# Altium project ultrazohm_digital_voltage_3U_1vxx.PrjPCB (part 2 of 3)

## Sheet TI_DS26C31T.SchDoc
size A4; Author: T. Wendt; CompanyName: Technische Hochschule Nürnberg Georg Simon Ohm; Address1: Fürther Straße 250; Address2: 90429 Nürnberg; Address3: GERMANY; DocumentNumber: 7; SheetNumber: 7; SheetTotal: 16; CompanyName2: Institut ELSYS
Used 8 times, as channels SigCon_top/RS422_top/RS422A, SigCon_top/RS422_top/RS4221, SigCon_top/RS422_top/RS4222, SigCon_top/RS422_top/RS4223, SigCon_top/RS422_top/RS4224, SigCon_top/RS422_top/RS4225, SigCon_top/RS422_top/RS4226, SigCon_top/RS422_top/RS4227. Parts and nets are listed once, with the designators drawn on the sheet.
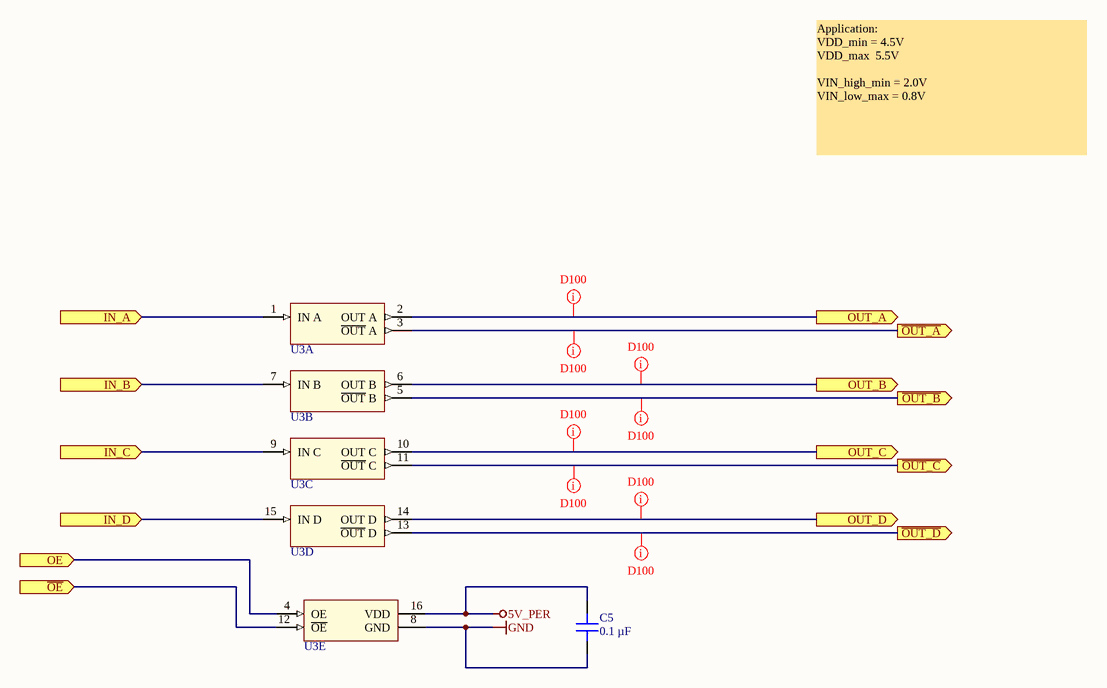
[diagram p9: TI_DS26C31T.SchDoc]

### Parts
C5  0.1 µF  [C_0603]
U3  DS26C31TMX/NOPB  [TI_D-R-PDSO-G16_N]  (value not drawn)  (parts A,B,C,D,E of 5)

### Ports
IN_A (in), IN_B (in), IN_C (in), IN_D (in), OE (in), OUT_A (out), OUT_B (out), OUT_C (out), OUT_D (out), ~{OE} (in), ~{OUT_A} (out), ~{OUT_B} (out), ~{OUT_C} (out), ~{OUT_D} (out)

### Nets
5V_PER: C5.2 U3.16(VDD)
GND: C5.1 U3.8(GND)
IN_A: U3.1(IN_A) ; port IN_A
IN_B: U3.7(IN_B) ; port IN_B
IN_C: U3.9(IN_C) ; port IN_C
IN_D: U3.15(IN_D) ; port IN_D
~{OE}: U3.12(~{OE}) ; port ~{OE}
~{OUT_A}: U3.3(~{OUT}_A) ; port ~{OUT_A}
~{OUT_B}: U3.5(~{OUT}_B) ; port ~{OUT_B}
~{OUT_C}: U3.11(~{OUT}_C) ; port ~{OUT_C}
~{OUT_D}: U3.13(~{OUT}_D) ; port ~{OUT_D}
OE: U3.4(OE) ; port OE
OUT_A: U3.2(OUT_A) ; port OUT_A
OUT_B: U3.6(OUT_B) ; port OUT_B
OUT_C: U3.10(OUT_C) ; port OUT_C
OUT_D: U3.14(OUT_D) ; port OUT_D

### Channels
SigCon_top/RS422_top/RS422A: designators end in A; ports IN_A=GND IN_B=GND IN_C=DIG_IO_5V_F5 IN_D=DIG_IO_5V_E5 OE=ENABLE OUT_A=NetU3A_2 OUT_B=NetU3A_6 OUT_C=DIG_I_DIFF_C_P8 OUT_D=DIG_I_DIFF_A_P8 ~{OE}=5V_PER ~{OUT_A}=NetU3A_3 ~{OUT_B}=NetU3A_5 ~{OUT_C}=DIG_I_DIFF_C_N8 ~{OUT_D}=DIG_I_DIFF_A_N8
SigCon_top/RS422_top/RS4221: designators end in B; ports IN_A=DIG_IO_5V_D1 IN_B=DIG_IO_5V_C1 IN_C=DIG_IO_5V_A1 IN_D=DIG_IO_5V_B1 OE=ENABLE OUT_A=DIG_I_DIFF_D_P1 OUT_B=DIG_I_DIFF_C_P1 OUT_C=DIG_I_DIFF_A_P1 OUT_D=DIG_I_DIFF_B_P1 ~{OE}=5V_PER ~{OUT_A}=DIG_I_DIFF_D_N1 ~{OUT_B}=DIG_I_DIFF_C_N1 ~{OUT_C}=DIG_I_DIFF_A_N1 ~{OUT_D}=DIG_I_DIFF_B_N1
SigCon_top/RS422_top/RS4222: designators end in C; ports IN_A=DIG_IO_5V_B2 IN_B=DIG_IO_5V_A2 IN_C=DIG_IO_5V_E1 IN_D=DIG_IO_5V_F1 OE=ENABLE OUT_A=DIG_I_DIFF_D_P2 OUT_B=DIG_I_DIFF_C_P2 OUT_C=DIG_I_DIFF_A_P2 OUT_D=DIG_I_DIFF_B_P2 ~{OE}=5V_PER ~{OUT_A}=DIG_I_DIFF_D_N2 ~{OUT_B}=DIG_I_DIFF_C_N2 ~{OUT_C}=DIG_I_DIFF_A_N2 ~{OUT_D}=DIG_I_DIFF_B_N2
SigCon_top/RS422_top/RS4223: designators end in D; ports IN_A=DIG_IO_5V_F2 IN_B=DIG_IO_5V_E2 IN_C=DIG_IO_5V_C2 IN_D=DIG_IO_5V_D2 OE=ENABLE OUT_A=DIG_I_DIFF_D_P3 OUT_B=DIG_I_DIFF_C_P3 OUT_C=DIG_I_DIFF_A_P3 OUT_D=DIG_I_DIFF_B_P3 ~{OE}=5V_PER ~{OUT_A}=DIG_I_DIFF_D_N3 ~{OUT_B}=DIG_I_DIFF_C_N3 ~{OUT_C}=DIG_I_DIFF_A_N3 ~{OUT_D}=DIG_I_DIFF_B_N3
SigCon_top/RS422_top/RS4224: designators end in E; ports IN_A=DIG_IO_5V_D3 IN_B=DIG_IO_5V_C3 IN_C=DIG_IO_5V_A3 IN_D=DIG_IO_5V_B3 OE=ENABLE OUT_A=DIG_I_DIFF_D_P4 OUT_B=DIG_I_DIFF_C_P4 OUT_C=DIG_I_DIFF_A_P4 OUT_D=DIG_I_DIFF_B_P4 ~{OE}=5V_PER ~{OUT_A}=DIG_I_DIFF_D_N4 ~{OUT_B}=DIG_I_DIFF_C_N4 ~{OUT_C}=DIG_I_DIFF_A_N4 ~{OUT_D}=DIG_I_DIFF_B_N4
SigCon_top/RS422_top/RS4225: designators end in F; ports IN_A=DIG_IO_5V_B4 IN_B=DIG_IO_5V_A4 IN_C=DIG_IO_5V_E3 IN_D=DIG_IO_5V_F3 OE=ENABLE OUT_A=DIG_I_DIFF_D_P5 OUT_B=DIG_I_DIFF_C_P5 OUT_C=DIG_I_DIFF_A_P5 OUT_D=DIG_I_DIFF_B_P5 ~{OE}=5V_PER ~{OUT_A}=DIG_I_DIFF_D_N5 ~{OUT_B}=DIG_I_DIFF_C_N5 ~{OUT_C}=DIG_I_DIFF_A_N5 ~{OUT_D}=DIG_I_DIFF_B_N5
SigCon_top/RS422_top/RS4226: designators end in G; ports IN_A=DIG_IO_5V_F4 IN_B=DIG_IO_5V_E4 IN_C=DIG_IO_5V_C4 IN_D=DIG_IO_5V_D4 OE=ENABLE OUT_A=DIG_I_DIFF_D_P6 OUT_B=DIG_I_DIFF_C_P6 OUT_C=DIG_I_DIFF_A_P6 OUT_D=DIG_I_DIFF_B_P6 ~{OE}=5V_PER ~{OUT_A}=DIG_I_DIFF_D_N6 ~{OUT_B}=DIG_I_DIFF_C_N6 ~{OUT_C}=DIG_I_DIFF_A_N6 ~{OUT_D}=DIG_I_DIFF_B_N6
SigCon_top/RS422_top/RS4227: designators end in H; ports IN_A=DIG_IO_5V_D5 IN_B=DIG_IO_5V_C5 IN_C=DIG_IO_5V_A5 IN_D=DIG_IO_5V_B5 OE=ENABLE OUT_A=DIG_I_DIFF_D_P7 OUT_B=DIG_I_DIFF_C_P7 OUT_C=DIG_I_DIFF_A_P7 OUT_D=DIG_I_DIFF_B_P7 ~{OE}=5V_PER ~{OUT_A}=DIG_I_DIFF_D_N7 ~{OUT_B}=DIG_I_DIFF_C_N7 ~{OUT_C}=DIG_I_DIFF_A_N7 ~{OUT_D}=DIG_I_DIFF_B_N7

### Layout directives
net class D100: DIG_I_DIFF_A_N8, DIG_I_DIFF_A_P8, DIG_I_DIFF_C_N8, DIG_I_DIFF_C_P8, NetU3A_2, NetU3A_3, NetU3A_5, NetU3A_6

### Notes on the sheet
- Application:
  VDD_min = 4.5V
  VDD_max  5.5V
  VIN_high_min = 2.0V
  VIN_low_max = 0.8V
- Title
- Size:
- Date:
- A4
- Revision:
- Time:
- Sheet
- of
- Author:
- Project:

### Library data of the parts
C5 = C0603X104K5RAC7411: as C1 on sheet TI_SN74LVCH16T245; Manufacturer Part Number: C0603X104K5RAC7411; PartID: 3; Created On: 20.12.2020 13:54:13; ComponentLink1Description: Datasheet; ComponentLink1URL: https://www.mouser.de/datasheet/2/212/1/KEM_C1013_X7R_FT_CAP_SMD-1103280.pdf; Component Type: Capacitor 0603; Device Package: 0603; Last Updated: 04.03.2021 09:24:28; Mounting Type: SMD; Operating Temperature: -55 - 125°C; Series: SMD Comm X7R Flex; Supplier 1: Mouser; Supplier Part Number 1: 80-C0603X104K5R7411; Type: Capacitor; Value: 0.1 µF; Live Cycle Status: 1; Stock number: Labor SMD Container; LCSC Part Number: C14663; Supplier 2: LCSC; Supplier Part Number 2: C14663
U3 = DS26C31TMX/NOPB: CMOS Quad Tri-State Differential Line Drivers, 16-pin Narrow SOIC, Pb-Free; Manufacturer: Texas Instruments; Created from: T. Wendt; PartID: 1; Created On: 01.03.2021 10:08:45; ComponentLink1Description: Datasheet; ComponentLink1URL: http://www.ti.com/general/docs/lit/getliterature.tsp?genericPartNumber=DS26C31T&fileType=pdf; Component Type: RS422 Driver; Device Package: SOIC; Last Updated: 04.03.2021 09:04:43; Manufacturer Part Number: DS26C31TMX/NOPB; Minimum Order: 1; Mounting Type: SMD; Operating Temperature: -40°C - 85°C; Series: DS26C31; Supplier 1: Digi-Key; Supplier Part Number 1: DS26C31TMX/NOPBCT-ND; Supplier 2: Mouser; Supplier Part Number 2: 926-DS26C31TMX/NOPB; Type: Standard; Live Cycle Status: 1; LCSC Part Number: C132085; Stock number: not stored; Supplier 3: LCSC; Supplier Part Number 3: C132085

## Sheet DifferentialToSingle.SchDoc
size A4; Author: T. Wendt; CompanyName: Technische Hochschule Nürnberg Georg Simon Ohm; Address1: Fürther Straße 250; Address2: 90429 Nürnberg; Address3: GERMANY; DocumentNumber: 8; SheetNumber: 8; SheetTotal: 16; CompanyName2: Institut ELSYS
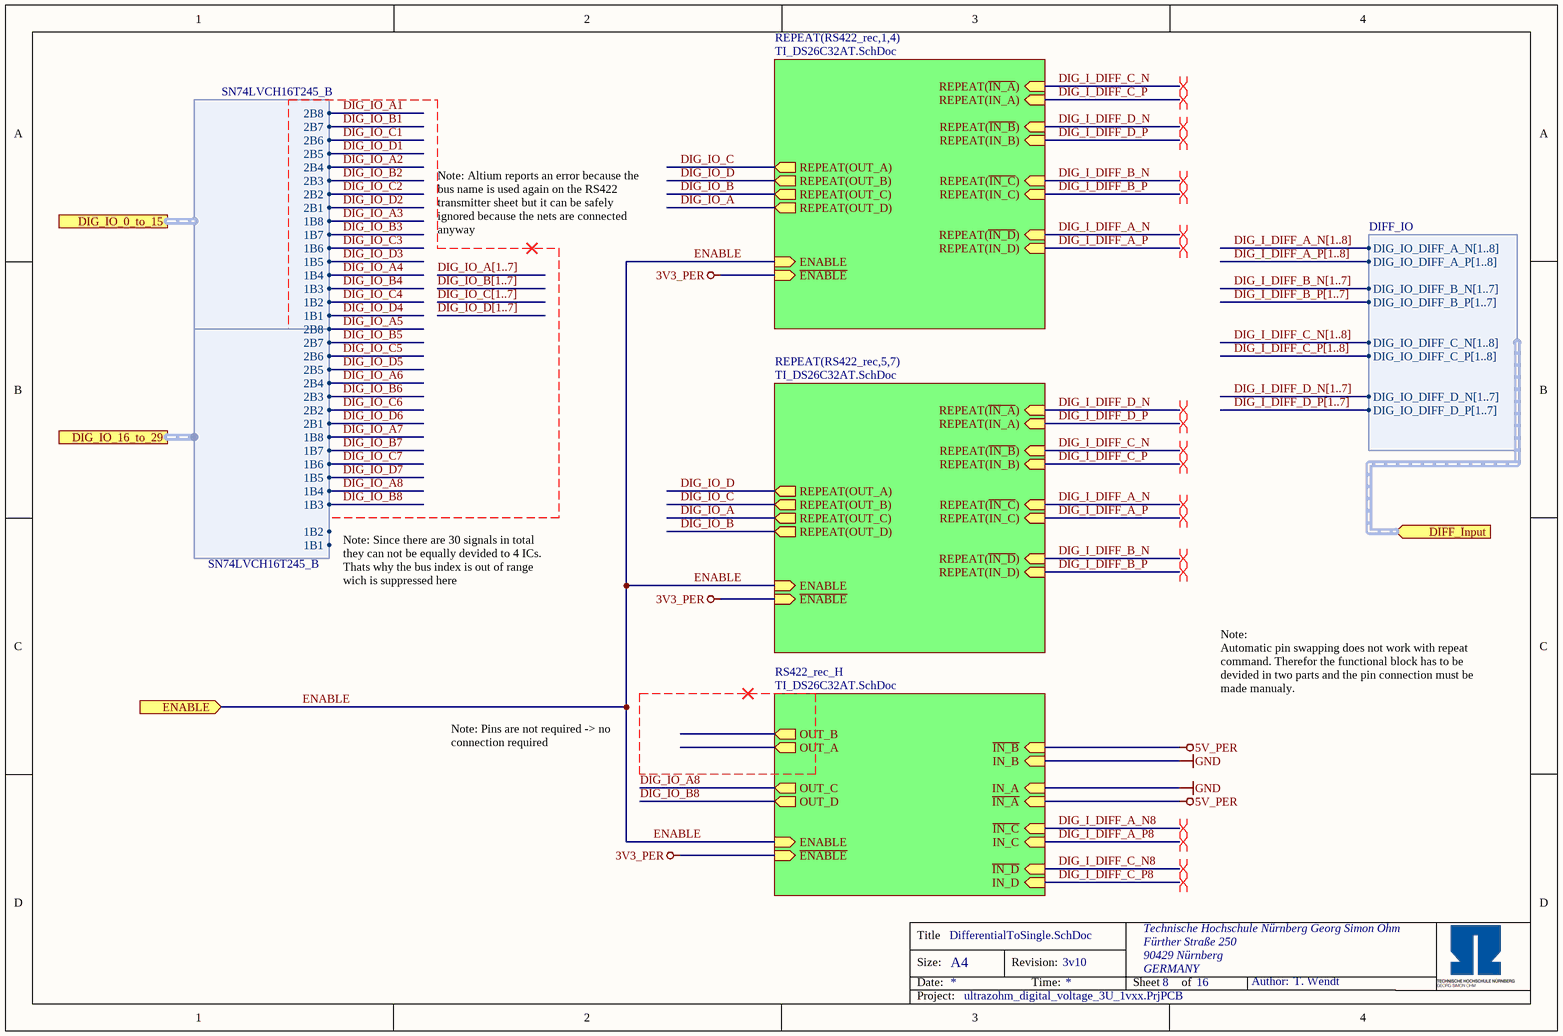
[diagram p10: DifferentialToSingle.SchDoc]

### Sub-sheets
REPEAT(RS422_rec,1,4) = TI_DS26C32AT.SchDoc: REPEAT(~{IN_A}) (in), REPEAT(IN_A) (in), REPEAT(~{IN_B}) (in), REPEAT(IN_B) (in), REPEAT(IN_C) (in), REPEAT(~{IN_D}) (in), REPEAT(IN_D) (in), REPEAT(OUT_A) (out), REPEAT(OUT_D) (out), REPEAT(OUT_B) (out), REPEAT(OUT_C) (out), ENABLE (in), ~{ENABLE} (in), REPEAT(~{IN_C}) (in)
REPEAT(RS422_rec,5,7) = TI_DS26C32AT.SchDoc: REPEAT(~{IN_A}) (in), REPEAT(IN_A) (in), REPEAT(~{IN_B}) (in), REPEAT(IN_B) (in), REPEAT(IN_C) (in), REPEAT(~{IN_C}) (in), REPEAT(~{IN_D}) (in), REPEAT(IN_D) (in), REPEAT(OUT_A) (out), REPEAT(OUT_D) (out), REPEAT(OUT_B) (out), REPEAT(OUT_C) (out), ENABLE (in), ~{ENABLE} (in)
RS422_rec_H = TI_DS26C32AT.SchDoc: OUT_C (out), OUT_D (out), ENABLE (in), ~{ENABLE} (in), ~{IN_D} (in), IN_D (in), ~{IN_C} (in), IN_C (in), IN_A (in), ~{IN_A} (in), ~{IN_B} (in), IN_B (in), OUT_B (out), OUT_A (out)

### Ports
DIFF_Input (in, harness DIFF_IO), DIG_IO_0_to_15 (harness SN74LVCH16T245_B), DIG_IO_16_to_29 (harness SN74LVCH16T245_B), ENABLE (in)

### Harnesses
DIFF_IO: DIG_IO_DIFF_A_N[1..8], DIG_IO_DIFF_A_P[1..8], DIG_IO_DIFF_B_N[1..7], DIG_IO_DIFF_B_P[1..7], DIG_IO_DIFF_C_N[1..8], DIG_IO_DIFF_C_P[1..8], DIG_IO_DIFF_D_N[1..7], DIG_IO_DIFF_D_P[1..7]
SN74LVCH16T245_B: 1B1, 1B2, 1B3, 1B4, 1B5, 1B6, 1B7, 1B8, 2B1, 2B2, 2B3, 2B4, 2B5, 2B6, 2B7, 2B8

### Nets
3V3_PER: sheet RS422_rec_H/~{ENABLE}, sheet REPEAT(RS422_rec,1,4)/~{ENABLE}, sheet REPEAT(RS422_rec,5,7)/~{ENABLE}
5V_PER: sheet RS422_rec_H/~{IN_A}, sheet RS422_rec_H/~{IN_B}
GND: sheet RS422_rec_H/IN_A, sheet RS422_rec_H/IN_B
DIG_I_DIFF_A_N: sheet REPEAT(RS422_rec,1,4)/REPEAT(~{IN_D}), sheet REPEAT(RS422_rec,5,7)/REPEAT(~{IN_C})
DIG_I_DIFF_A_P: sheet REPEAT(RS422_rec,1,4)/REPEAT(IN_D), sheet REPEAT(RS422_rec,5,7)/REPEAT(IN_C)
DIG_I_DIFF_B_N: sheet REPEAT(RS422_rec,1,4)/REPEAT(~{IN_C}), sheet REPEAT(RS422_rec,5,7)/REPEAT(~{IN_D})
DIG_I_DIFF_B_P: sheet REPEAT(RS422_rec,1,4)/REPEAT(IN_C), sheet REPEAT(RS422_rec,5,7)/REPEAT(IN_D)
DIG_I_DIFF_C_N: sheet REPEAT(RS422_rec,1,4)/REPEAT(~{IN_A}), sheet REPEAT(RS422_rec,5,7)/REPEAT(~{IN_B})
DIG_I_DIFF_C_P: sheet REPEAT(RS422_rec,1,4)/REPEAT(IN_A), sheet REPEAT(RS422_rec,5,7)/REPEAT(IN_B)
DIG_I_DIFF_D_N: sheet REPEAT(RS422_rec,1,4)/REPEAT(~{IN_B}), sheet REPEAT(RS422_rec,5,7)/REPEAT(~{IN_A})
DIG_I_DIFF_D_P: sheet REPEAT(RS422_rec,1,4)/REPEAT(IN_B), sheet REPEAT(RS422_rec,5,7)/REPEAT(IN_A)
DIG_IO_A: sheet REPEAT(RS422_rec,1,4)/REPEAT(OUT_D), sheet REPEAT(RS422_rec,5,7)/REPEAT(OUT_C)
DIG_IO_A8: sheet RS422_rec_H/OUT_C, port DIG_IO_16_to_29.1B4  [project net DIG_IO_5V_E5]
DIG_IO_B: sheet REPEAT(RS422_rec,1,4)/REPEAT(OUT_C), sheet REPEAT(RS422_rec,5,7)/REPEAT(OUT_D)
DIG_IO_B8: sheet RS422_rec_H/OUT_D, port DIG_IO_16_to_29.1B3  [project net DIG_IO_5V_F5]
DIG_IO_C: sheet REPEAT(RS422_rec,1,4)/REPEAT(OUT_A), sheet REPEAT(RS422_rec,5,7)/REPEAT(OUT_B)
DIG_IO_D: sheet REPEAT(RS422_rec,1,4)/REPEAT(OUT_B), sheet REPEAT(RS422_rec,5,7)/REPEAT(OUT_A)
ENABLE: port ENABLE, sheet RS422_rec_H/ENABLE, sheet REPEAT(RS422_rec,1,4)/ENABLE, sheet REPEAT(RS422_rec,5,7)/ENABLE

### Buses and harness runs
bus DIG_I_DIFF_A_N[1..8]
bus DIG_I_DIFF_A_P[1..8]
bus DIG_I_DIFF_B_N[1..7]
bus DIG_I_DIFF_B_P[1..7]
bus DIG_I_DIFF_C_N[1..8]
bus DIG_I_DIFF_C_P[1..8]
bus DIG_I_DIFF_D_N[1..7]
bus DIG_I_DIFF_D_P[1..7]
bus DIG_IO_A[1..7]
bus DIG_IO_B[1..7]
bus DIG_IO_C[1..7]
bus DIG_IO_D[1..7]

### Layout directives
differential pair: DIG_I_DIFF_A_N, DIG_I_DIFF_A_N8, DIG_I_DIFF_A_P, DIG_I_DIFF_A_P8, DIG_I_DIFF_B_N, DIG_I_DIFF_B_P, DIG_I_DIFF_C_N, DIG_I_DIFF_C_N8, DIG_I_DIFF_C_P, DIG_I_DIFF_C_P8, DIG_I_DIFF_D_N, DIG_I_DIFF_D_P

### Notes on the sheet
- Note: Altium reports an error because the bus name is used again on the RS422 transmitter sheet but it can be safely ignored because the nets are connected anyway
- Note: Since there are 30 signals in total they can not be equally devided to 4 ICs. Thats why the bus index is out of range wich is suppressed here
- Note:
  Automatic pin swapping does not work with repeat command. Therefor the functional block has to be devided in two parts and the pin connection must be made manualy.
- Note: Pins are not required -> no connection required
- Title
- Size:
- Date:
- A4
- Revision:
- Time:
- Sheet
- of
- Author:
- Project:

## Sheet TI_DS26C32AT.SchDoc
size A4; Author: T. Wendt; CompanyName: Technische Hochschule Nürnberg Georg Simon Ohm; Address1: Fürther Straße 250; Address2: 90429 Nürnberg; Address3: GERMANY; DocumentNumber: 9; SheetNumber: 9; SheetTotal: 16; CompanyName2: Institut ELSYS
Used 8 times, as channels SigCon_top/RS422_rec_top/RS422_rec_H, SigCon_top/RS422_rec_top/RS422_rec1, SigCon_top/RS422_rec_top/RS422_rec2, SigCon_top/RS422_rec_top/RS422_rec3, SigCon_top/RS422_rec_top/RS422_rec4, SigCon_top/RS422_rec_top/RS422_rec5, SigCon_top/RS422_rec_top/RS422_rec6, SigCon_top/RS422_rec_top/RS422_rec7. Parts and nets are listed once, with the designators drawn on the sheet.
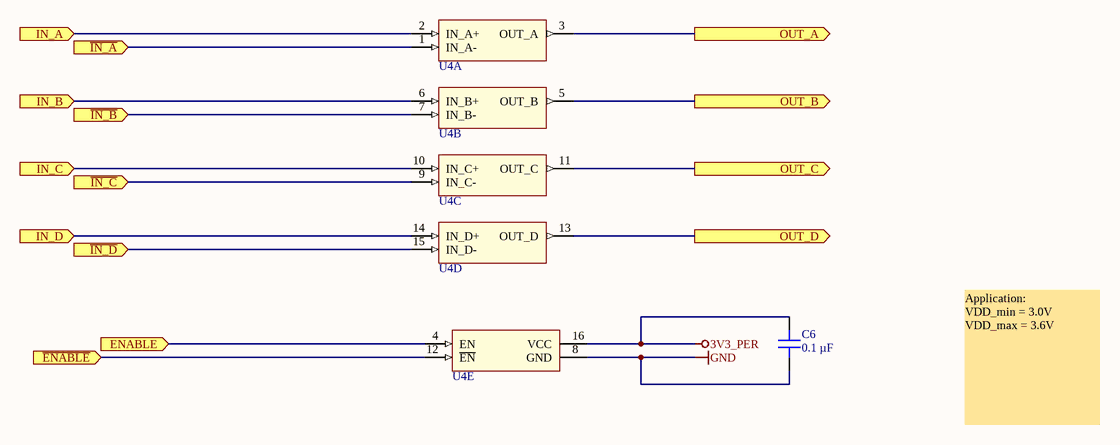
[diagram p11: TI_DS26C32AT.SchDoc]

### Parts
C6  0.1 µF  [C_0603]
U4  DS26LV32ATM/NOPB  [TI_D-R-PDSO-G16_N]  (value not drawn)  (parts A,B,C,D,E of 5)

### Ports
ENABLE (in), IN_A (in), IN_B (in), IN_C (in), IN_D (in), OUT_A (out), OUT_B (out), OUT_C (out), OUT_D (out), ~{ENABLE} (in), ~{IN_A} (in), ~{IN_B} (in), ~{IN_C} (in), ~{IN_D} (in)

### Nets
3V3_PER: C6.2 U4.16(VCC)
GND: C6.1 U4.8(GND)
~{ENABLE}: U4.12(~{EN}) ; port ~{ENABLE}
ENABLE: U4.4(EN) ; port ENABLE
~{IN_A}: U4.1(IN_A-) ; port ~{IN_A}
~{IN_B}: U4.7(IN_B-) ; port ~{IN_B}
~{IN_C}: U4.9(IN_C-) ; port ~{IN_C}
~{IN_D}: U4.15(IN_D-) ; port ~{IN_D}
IN_A: U4.2(IN_A+) ; port IN_A
IN_B: U4.6(IN_B+) ; port IN_B
IN_C: U4.10(IN_C+) ; port IN_C
IN_D: U4.14(IN_D+) ; port IN_D
OUT_A: U4.3(OUT_A) ; port OUT_A
OUT_B: U4.5(OUT_B) ; port OUT_B
OUT_C: U4.11(OUT_C) ; port OUT_C
OUT_D: U4.13(OUT_D) ; port OUT_D

### Channels
SigCon_top/RS422_rec_top/RS422_rec_H: designators end in A; ports ENABLE=ENABLE IN_A=GND IN_B=GND IN_C=DIG_I_DIFF_A_P8 IN_D=DIG_I_DIFF_C_P8 OUT_A=NetU4A_3 OUT_B=NetU4A_5 OUT_C=DIG_IO_5V_E5 OUT_D=DIG_IO_5V_F5 ~{ENABLE}=3V3_PER ~{IN_A}=5V_PER ~{IN_B}=5V_PER ~{IN_C}=DIG_I_DIFF_A_N8 ~{IN_D}=DIG_I_DIFF_C_N8
SigCon_top/RS422_rec_top/RS422_rec1: designators end in B; ports ENABLE=ENABLE IN_A=DIG_I_DIFF_C_P1 IN_B=DIG_I_DIFF_D_P1 IN_C=DIG_I_DIFF_B_P1 IN_D=DIG_I_DIFF_A_P1 OUT_A=DIG_IO_5V_C1 OUT_B=DIG_IO_5V_D1 OUT_C=DIG_IO_5V_B1 OUT_D=DIG_IO_5V_A1 ~{ENABLE}=3V3_PER ~{IN_A}=DIG_I_DIFF_C_N1 ~{IN_B}=DIG_I_DIFF_D_N1 ~{IN_C}=DIG_I_DIFF_B_N1 ~{IN_D}=DIG_I_DIFF_A_N1
SigCon_top/RS422_rec_top/RS422_rec2: designators end in C; ports ENABLE=ENABLE IN_A=DIG_I_DIFF_C_P2 IN_B=DIG_I_DIFF_D_P2 IN_C=DIG_I_DIFF_B_P2 IN_D=DIG_I_DIFF_A_P2 OUT_A=DIG_IO_5V_A2 OUT_B=DIG_IO_5V_B2 OUT_C=DIG_IO_5V_F1 OUT_D=DIG_IO_5V_E1 ~{ENABLE}=3V3_PER ~{IN_A}=DIG_I_DIFF_C_N2 ~{IN_B}=DIG_I_DIFF_D_N2 ~{IN_C}=DIG_I_DIFF_B_N2 ~{IN_D}=DIG_I_DIFF_A_N2
SigCon_top/RS422_rec_top/RS422_rec3: designators end in D; ports ENABLE=ENABLE IN_A=DIG_I_DIFF_C_P3 IN_B=DIG_I_DIFF_D_P3 IN_C=DIG_I_DIFF_B_P3 IN_D=DIG_I_DIFF_A_P3 OUT_A=DIG_IO_5V_E2 OUT_B=DIG_IO_5V_F2 OUT_C=DIG_IO_5V_D2 OUT_D=DIG_IO_5V_C2 ~{ENABLE}=3V3_PER ~{IN_A}=DIG_I_DIFF_C_N3 ~{IN_B}=DIG_I_DIFF_D_N3 ~{IN_C}=DIG_I_DIFF_B_N3 ~{IN_D}=DIG_I_DIFF_A_N3
SigCon_top/RS422_rec_top/RS422_rec4: designators end in E; ports ENABLE=ENABLE IN_A=DIG_I_DIFF_C_P4 IN_B=DIG_I_DIFF_D_P4 IN_C=DIG_I_DIFF_B_P4 IN_D=DIG_I_DIFF_A_P4 OUT_A=DIG_IO_5V_C3 OUT_B=DIG_IO_5V_D3 OUT_C=DIG_IO_5V_B3 OUT_D=DIG_IO_5V_A3 ~{ENABLE}=3V3_PER ~{IN_A}=DIG_I_DIFF_C_N4 ~{IN_B}=DIG_I_DIFF_D_N4 ~{IN_C}=DIG_I_DIFF_B_N4 ~{IN_D}=DIG_I_DIFF_A_N4
SigCon_top/RS422_rec_top/RS422_rec5: designators end in F; ports ENABLE=ENABLE IN_A=DIG_I_DIFF_D_P5 IN_B=DIG_I_DIFF_C_P5 IN_C=DIG_I_DIFF_A_P5 IN_D=DIG_I_DIFF_B_P5 OUT_A=DIG_IO_5V_B4 OUT_B=DIG_IO_5V_A4 OUT_C=DIG_IO_5V_E3 OUT_D=DIG_IO_5V_F3 ~{ENABLE}=3V3_PER ~{IN_A}=DIG_I_DIFF_D_N5 ~{IN_B}=DIG_I_DIFF_C_N5 ~{IN_C}=DIG_I_DIFF_A_N5 ~{IN_D}=DIG_I_DIFF_B_N5
SigCon_top/RS422_rec_top/RS422_rec6: designators end in G; ports ENABLE=ENABLE IN_A=DIG_I_DIFF_D_P6 IN_B=DIG_I_DIFF_C_P6 IN_C=DIG_I_DIFF_A_P6 IN_D=DIG_I_DIFF_B_P6 OUT_A=DIG_IO_5V_F4 OUT_B=DIG_IO_5V_E4 OUT_C=DIG_IO_5V_C4 OUT_D=DIG_IO_5V_D4 ~{ENABLE}=3V3_PER ~{IN_A}=DIG_I_DIFF_D_N6 ~{IN_B}=DIG_I_DIFF_C_N6 ~{IN_C}=DIG_I_DIFF_A_N6 ~{IN_D}=DIG_I_DIFF_B_N6
SigCon_top/RS422_rec_top/RS422_rec7: designators end in H; ports ENABLE=ENABLE IN_A=DIG_I_DIFF_D_P7 IN_B=DIG_I_DIFF_C_P7 IN_C=DIG_I_DIFF_A_P7 IN_D=DIG_I_DIFF_B_P7 OUT_A=DIG_IO_5V_D5 OUT_B=DIG_IO_5V_C5 OUT_C=DIG_IO_5V_A5 OUT_D=DIG_IO_5V_B5 ~{ENABLE}=3V3_PER ~{IN_A}=DIG_I_DIFF_D_N7 ~{IN_B}=DIG_I_DIFF_C_N7 ~{IN_C}=DIG_I_DIFF_A_N7 ~{IN_D}=DIG_I_DIFF_B_N7

### Notes on the sheet
- Application:
  VDD_min = 3.0V
  VDD_max = 3.6V
- Title
- Size:
- Date:
- A4
- Revision:
- Time:
- Sheet
- of
- Author:
- Project:

### Library data of the parts
C6 = C0603X104K5RAC7411: as C1 on sheet TI_SN74LVCH16T245; Manufacturer Part Number: C0603X104K5RAC7411; PartID: 3; Created On: 20.12.2020 13:54:13; ComponentLink1Description: Datasheet; ComponentLink1URL: https://www.mouser.de/datasheet/2/212/1/KEM_C1013_X7R_FT_CAP_SMD-1103280.pdf; Component Type: Capacitor 0603; Device Package: 0603; Last Updated: 04.03.2021 09:24:28; Mounting Type: SMD; Operating Temperature: -55 - 125°C; Series: SMD Comm X7R Flex; Supplier 1: Mouser; Supplier Part Number 1: 80-C0603X104K5R7411; Type: Capacitor; Value: 0.1 µF; Live Cycle Status: 1; Stock number: Labor SMD Container; LCSC Part Number: C14663; Supplier 2: LCSC; Supplier Part Number 2: C14663
U4 = DS26LV32ATM/NOPB: 3V Enhanced CMOS Quad Differential Line Receiver, 16-pin Narrow SOIC, Pb-Free; Manufacturer: Texas Instruments; Created from: T. Wendt; PartID: 2; Created On: 01.03.2021 10:35:45; ComponentLink1Description: Datasheet; ComponentLink1URL: http://www.ti.com/general/docs/lit/getliterature.tsp?genericPartNumber=DS26LV32AT&fileType=pdf; Component Type: RS422 Receiver; Device Package: SOIC; Last Updated: 04.03.2021 09:04:43; Manufacturer Part Number: DS26LV32ATM/NOPB; Minimum Order: 1; Mounting Type: SMD; Operating Temperature: -40°C - 85°C; Series: DS26LV32; Supplier 1: Mouser; Supplier Part Number 1: 926-DS26LV32ATM/NOPB; Supplier 2: Mouser; Supplier Part Number 2: 926-DS26LV32ATMXNOPB; Type: Standard; Live Cycle Status: 1; LCSC Part Number: C59861; Stock number: not stored; Supplier 3: LCSC; Supplier Part Number 3: C59861

## Sheet SignalBundling.SchDoc
size A4; Author: T. Wendt; CompanyName: Technische Hochschule Nürnberg Georg Simon Ohm; Address1: Fürther Straße 250; Address2: 90429 Nürnberg; Address3: GERMANY; DocumentNumber: 10; SheetNumber: 10; SheetTotal: 16; CompanyName2: Institut ELSYS
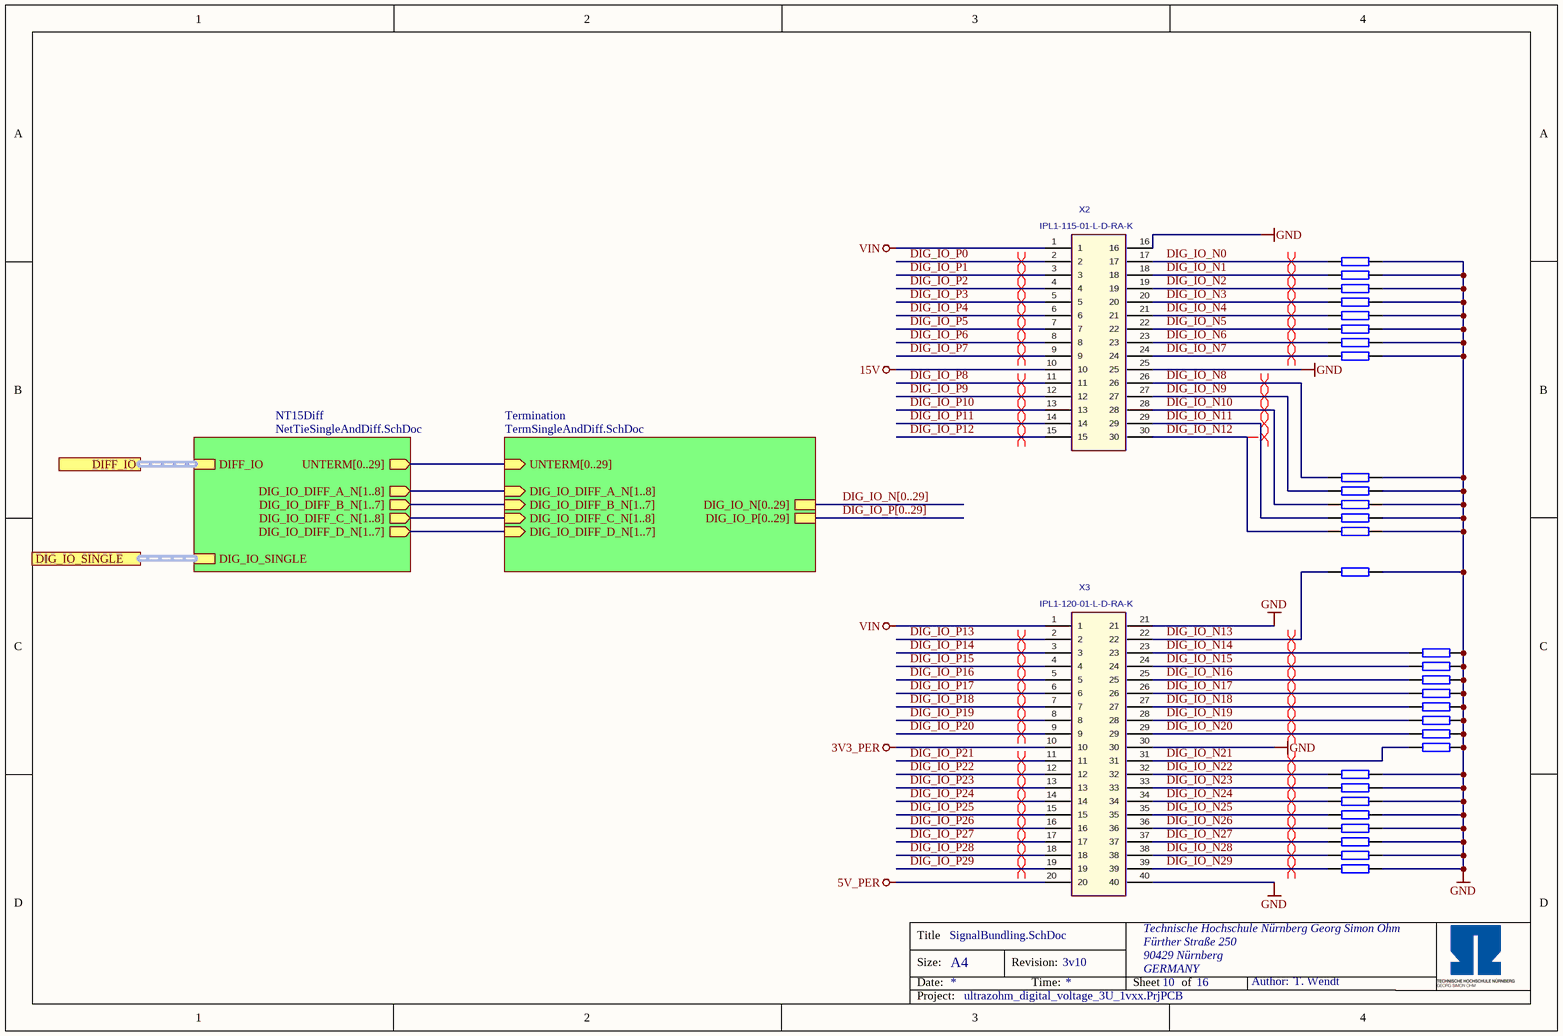
[diagram p12: SignalBundling.SchDoc]

### Parts
R21  0R  [RES 0603_1608]  (value not drawn)
R22  0R  [RES 0603_1608]  (value not drawn)
R23  0R  [RES 0603_1608]  (value not drawn)
R24  0R  [RES 0603_1608]  (value not drawn)
R25  0R  [RES 0603_1608]  (value not drawn)
R26  0R  [RES 0603_1608]  (value not drawn)
R27  0R  [RES 0603_1608]  (value not drawn)
R28  0R  [RES 0603_1608]  (value not drawn)
R29  0R  [RES 0603_1608]  (value not drawn)
R30  0R  [RES 0603_1608]  (value not drawn)
R31  0R  [RES 0603_1608]  (value not drawn)
R32  0R  [RES 0603_1608]  (value not drawn)
R33  0R  [RES 0603_1608]  (value not drawn)
R34  0R  [RES 0603_1608]  (value not drawn)
R35  0R  [RES 0603_1608]  (value not drawn)
R36  0R  [RES 0603_1608]  (value not drawn)
R37  0R  [RES 0603_1608]  (value not drawn)
R38  0R  [RES 0603_1608]  (value not drawn)
R39  0R  [RES 0603_1608]  (value not drawn)
R40  0R  [RES 0603_1608]  (value not drawn)
R41  0R  [RES 0603_1608]  (value not drawn)
R42  0R  [RES 0603_1608]  (value not drawn)
R43  0R  [RES 0603_1608]  (value not drawn)
R44  0R  [RES 0603_1608]  (value not drawn)
R45  0R  [RES 0603_1608]  (value not drawn)
R46  0R  [RES 0603_1608]  (value not drawn)
R47  0R  [RES 0603_1608]  (value not drawn)
R48  0R  [RES 0603_1608]  (value not drawn)
R49  0R  [RES 0603_1608]  (value not drawn)
R50  0R  [RES 0603_1608]  (value not drawn)
X2  IPL1-115-01-L-D-RA-K  [IPL1-115-01-XX-D-RA]
X3  IPL1-120-01-L-D-RA-K  [IPL1-120-01-XX-D-RA]

### Sub-sheets
NT15Diff = NetTieSingleAndDiff.SchDoc: DIG_IO_DIFF_B_N[1..7] (out), UNTERM[0..29] (out), DIG_IO_DIFF_D_N[1..7] (out), DIG_IO_DIFF_C_N[1..8] (out), DIG_IO_DIFF_A_N[1..8] (out), DIFF_IO (harness DIFF_IO), DIG_IO_SINGLE (harness DIG_IO_SINGLE)
Termination = TermSingleAndDiff.SchDoc: UNTERM[0..29] (in), DIG_IO_DIFF_A_N[1..8] (in), DIG_IO_DIFF_C_N[1..8] (in), DIG_IO_DIFF_B_N[1..7] (in), DIG_IO_DIFF_D_N[1..7] (in), DIG_IO_P[0..29], DIG_IO_N[0..29]

### Ports
DIFF_IO (harness DIFF_IO), DIG_IO_SINGLE (harness DIG_IO_SINGLE)

### Nets
3V3_PER: X3.10
5V_PER: X3.20
15V: X2.10
GND: R21.2 R22.2 R23.2 R24.2 R25.2 R26.2 R27.2 R28.2 R29.2 R30.2 R31.2 R32.2 R33.2 R34.2 R35.2 R36.2 R37.2 R38.2 R39.2 R40.2 R41.2 R42.2 R43.2 R44.2 R45.2 R46.2 R47.2 R48.2 R49.2 R50.2 X2.16 X2.25 X3.21 X3.30 X3.40
VIN: X2.1 X3.1
DIG_IO_N0: R21.1 X2.17
DIG_IO_N1: R22.1 X2.18
DIG_IO_N2: R23.1 X2.19
DIG_IO_N3: R24.1 X2.20
DIG_IO_N4: R25.1 X2.21
DIG_IO_N5: R26.1 X2.22
DIG_IO_N6: R27.1 X2.23
DIG_IO_N7: R28.1 X2.24
DIG_IO_N8: R29.1 X2.26
DIG_IO_N9: R30.1 X2.27
DIG_IO_N10: R31.1 X2.28
DIG_IO_N11: R32.1 X2.29
DIG_IO_N12: R33.1 X2.30
DIG_IO_N13: R34.1 X3.22
DIG_IO_N14: R35.1 X3.23
DIG_IO_N15: R36.1 X3.24
DIG_IO_N16: R37.1 X3.25
DIG_IO_N17: R38.1 X3.26
DIG_IO_N18: R39.1 X3.27
DIG_IO_N19: R40.1 X3.28
DIG_IO_N20: R41.1 X3.29
DIG_IO_N21: R42.1 X3.31
DIG_IO_N22: R43.1 X3.32
DIG_IO_N23: R44.1 X3.33
DIG_IO_N24: R45.1 X3.34
DIG_IO_N25: R46.1 X3.35
DIG_IO_N26: R47.1 X3.36
DIG_IO_N27: R48.1 X3.37
DIG_IO_N28: R49.1 X3.38
DIG_IO_N29: R50.1 X3.39
DIG_IO_P0: X2.2
DIG_IO_P1: X2.3
DIG_IO_P2: X2.4
DIG_IO_P3: X2.5
DIG_IO_P4: X2.6
DIG_IO_P5: X2.7
DIG_IO_P6: X2.8
DIG_IO_P7: X2.9
DIG_IO_P8: X2.11
DIG_IO_P9: X2.12
DIG_IO_P10: X2.13
DIG_IO_P11: X2.14
DIG_IO_P12: X2.15
DIG_IO_P13: X3.2
DIG_IO_P14: X3.3
DIG_IO_P15: X3.4
DIG_IO_P16: X3.5
DIG_IO_P17: X3.6
DIG_IO_P18: X3.7
DIG_IO_P19: X3.8
DIG_IO_P20: X3.9
DIG_IO_P21: X3.11
DIG_IO_P22: X3.12
DIG_IO_P23: X3.13
DIG_IO_P24: X3.14
DIG_IO_P25: X3.15
DIG_IO_P26: X3.16
DIG_IO_P27: X3.17
DIG_IO_P28: X3.18
DIG_IO_P29: X3.19

### Buses and harness runs
bus DIG_IO_N[0..29] = sheet Termination/DIG_IO_N[0..29]
bus DIG_IO_P[0..29] = sheet Termination/DIG_IO_P[0..29]
bus sheet NT15Diff/DIG_IO_DIFF_A_N[1..8] = sheet Termination/DIG_IO_DIFF_A_N[1..8]
bus sheet NT15Diff/DIG_IO_DIFF_B_N[1..7] = sheet Termination/DIG_IO_DIFF_B_N[1..7]
bus sheet NT15Diff/DIG_IO_DIFF_C_N[1..8] = sheet Termination/DIG_IO_DIFF_C_N[1..8]
bus sheet NT15Diff/DIG_IO_DIFF_D_N[1..7] = sheet Termination/DIG_IO_DIFF_D_N[1..7]
bus sheet NT15Diff/UNTERM[0..29] = sheet Termination/UNTERM[0..29]
harness port DIFF_IO = sheet NT15Diff/DIFF_IO
harness port DIG_IO_SINGLE = sheet NT15Diff/DIG_IO_SINGLE

### Layout directives
differential pair: DIG_IO_N0, DIG_IO_N1, DIG_IO_N2, DIG_IO_N3, DIG_IO_N4, DIG_IO_N5, DIG_IO_N6, DIG_IO_N7, DIG_IO_N8, DIG_IO_N9, DIG_IO_N10, DIG_IO_N11, DIG_IO_N12, DIG_IO_N13, DIG_IO_N14, DIG_IO_N15, DIG_IO_N16, DIG_IO_N17, DIG_IO_N18, DIG_IO_N19, DIG_IO_N20, DIG_IO_N21, DIG_IO_N22, DIG_IO_N23, DIG_IO_N24, DIG_IO_N25, DIG_IO_N26, DIG_IO_N27, DIG_IO_N28, DIG_IO_N29, DIG_IO_P0, DIG_IO_P1, DIG_IO_P2, DIG_IO_P3, DIG_IO_P4, DIG_IO_P5, DIG_IO_P6, DIG_IO_P7, DIG_IO_P8, DIG_IO_P9, DIG_IO_P10, DIG_IO_P11, DIG_IO_P12, DIG_IO_P13, DIG_IO_P14, DIG_IO_P15, DIG_IO_P16, DIG_IO_P17, DIG_IO_P18, DIG_IO_P19, DIG_IO_P20, DIG_IO_P21, DIG_IO_P22, DIG_IO_P23, DIG_IO_P24, DIG_IO_P25, DIG_IO_P26, DIG_IO_P27, DIG_IO_P28, DIG_IO_P29

### Notes on the sheet
- Title
- Size:
- Date:
- A4
- Revision:
- Time:
- Sheet
- of
- Author:
- Project:

### Library data of the parts
R21-R50 = RC0603JR-070RL: SMD resistor E24 series; Manufacturer: YAGEO; Tolerance: 5%; Created from: MGremer; Manufacturer Part Number: RC0603JR-070RL; PartID: 1; Created On: 14.12.2020 16:17:14; ComponentLink1Description: Datasheet; ComponentLink1URL: https://www.mouser.de/datasheet/2/447/PYu-RC_Group_51_RoHS_L_10-1664068.pdf; Component Type: SMD resistor; Device Package: 0603; Last Updated: 04.03.2021 09:09:42; Mounting Type: SMD; Supplier 1: Mouser; Supplier Part Number 1: 603-RC0603JR-070RL; Type: Resistor; Value: 0R; Live Cycle Status: 1; Stock number: Labor SMD Container; LCSC Part Number: C21189; Supplier 2: LCSC; Supplier Part Number 2: C21189
X2 = IPL1-115-01-L-D-RA-K: Terminal Assembly, Double Row, Right Angle, Thru-Hole, 2.54 mm x 2.54 mm Pitch, 30 Pins; Manufacturer: SAMTEC; Created from: TWendt; Number of positions: 30; Manufacturer Part Number: IPL1-115-01-L-D-RA-K; PartID: 34; Created On: 12.02.2021 15:31:18; ComponentLink1Description: Homepage; ComponentLink1URL: https://www.samtec.com/products/ipl1; Component Type: Samtec Connector; Device Package: Connector; Last Updated: 15.02.2021 10:07:42; Supplier 1: SAMTEC; Supplier Part Number 1: IPL1-115-01-L-D-RA-K; Type: Connector; Live Cycle Status: 1; Number of rows: 2; Stock number: not stored
X3 = IPL1-120-01-L-D-RA-K: Terminal Assembly, Double Row, Right Angle, Thru-Hole, 2.54 mm x 2.54 mm Pitch, 40 Pins; Manufacturer: SAMTEC; Created from: TWendt; Number of positions: 40; Manufacturer Part Number: IPL1-120-01-L-D-RA-K; PartID: 33; Created On: 12.02.2021 15:26:11; ComponentLink1Description: Homepage; ComponentLink1URL: https://www.samtec.com/products/ipl1; Component Type: Samtec Connector; Device Package: Connector; Last Updated: 15.02.2021 10:07:42; Mounting Type: THT; Supplier 1: SAMTEC; Supplier Part Number 1: IPL1-120-01-L-D-RA-K; Type: Connector; Live Cycle Status: 1; Number of rows: 2; Stock number: not stored

## Sheet NetTieSingleAndDiff.SchDoc
size A4; Author: T. Wendt; CompanyName: Technische Hochschule Nürnberg Georg Simon Ohm; Address1: Fürther Straße 250; Address2: 90429 Nürnberg; Address3: GERMANY; DocumentNumber: 11; SheetNumber: 11; SheetTotal: 16; CompanyName2: Institut ELSYS
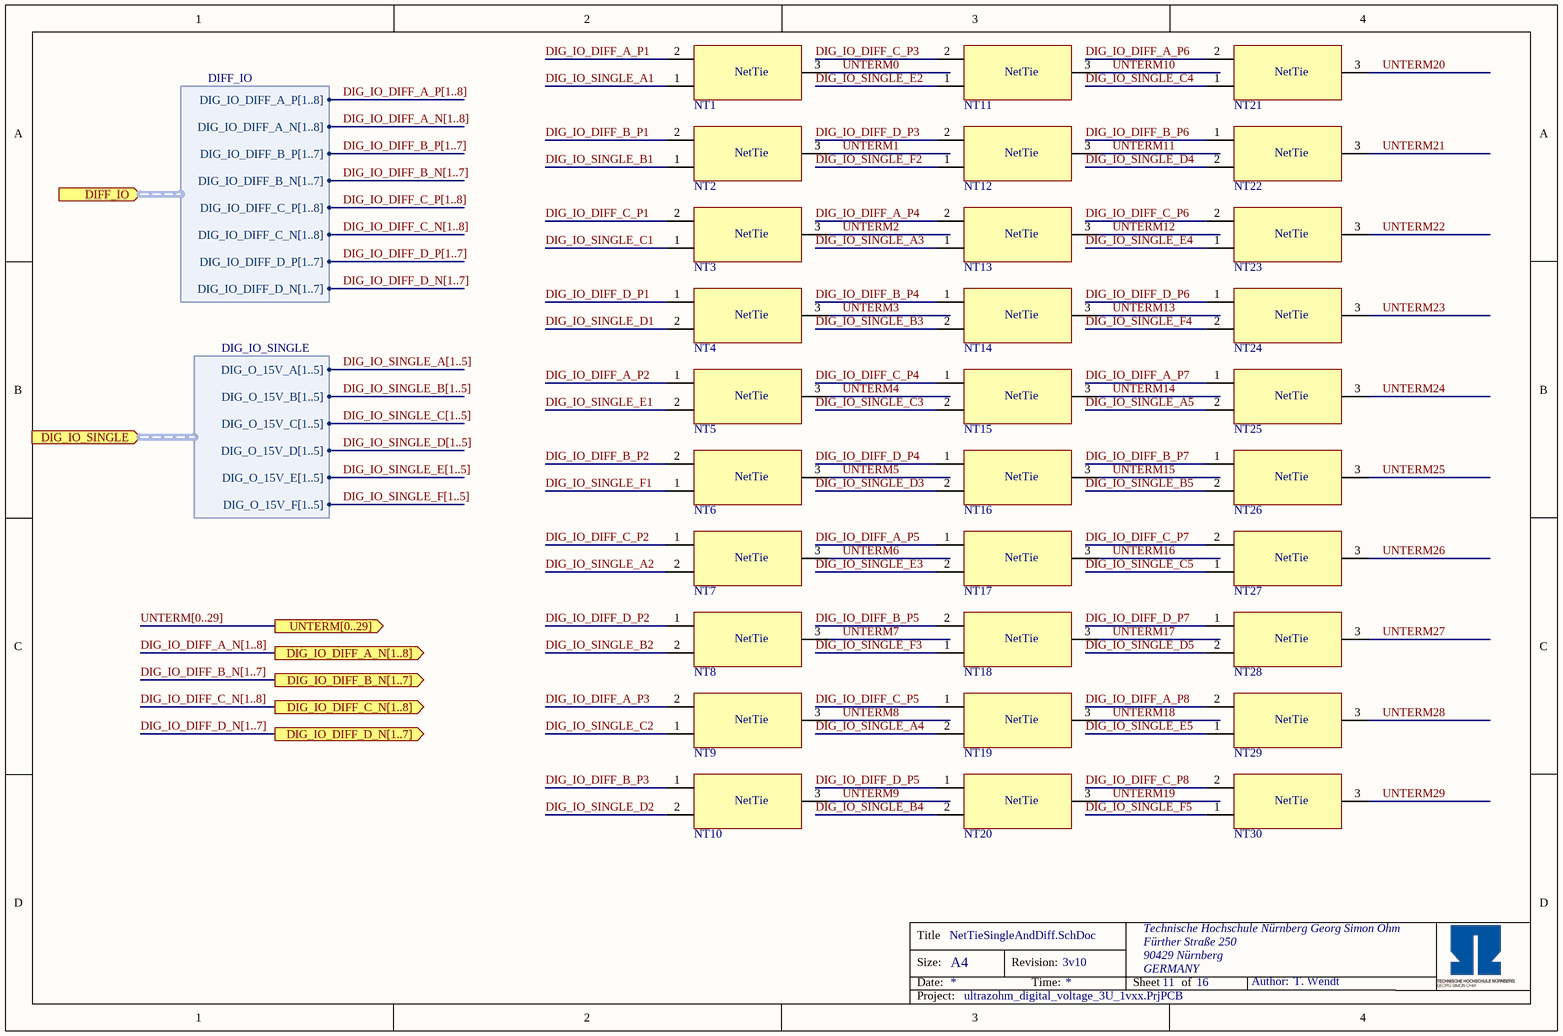
[diagram p13: NetTieSingleAndDiff.SchDoc]

### Parts
NT1  Net Tie 2 to 1  [2_to_1_NETTIE_TH_170u]  (value not drawn)  (net tie, no BOM)
NT2  Net Tie 2 to 1  [2_to_1_NETTIE_TH_170u]  (value not drawn)  (net tie, no BOM)
NT3  Net Tie 2 to 1  [2_to_1_NETTIE_TH_170u]  (value not drawn)  (net tie, no BOM)
NT4  Net Tie 2 to 1  [2_to_1_NETTIE_TH_170u]  (value not drawn)  (net tie, no BOM)
NT5  Net Tie 2 to 1  [2_to_1_NETTIE_TH_170u]  (value not drawn)  (net tie, no BOM)
NT6  Net Tie 2 to 1  [2_to_1_NETTIE_TH_170u]  (value not drawn)  (net tie, no BOM)
NT7  Net Tie 2 to 1  [2_to_1_NETTIE_TH_170u]  (value not drawn)  (net tie, no BOM)
NT8  Net Tie 2 to 1  [2_to_1_NETTIE_TH_170u]  (value not drawn)  (net tie, no BOM)
NT9  Net Tie 2 to 1  [2_to_1_NETTIE_TH_170u]  (value not drawn)  (net tie, no BOM)
NT10  Net Tie 2 to 1  [2_to_1_NETTIE_TH_170u]  (value not drawn)  (net tie, no BOM)
NT11  Net Tie 2 to 1  [2_to_1_NETTIE_TH_170u]  (value not drawn)  (net tie, no BOM)
NT12  Net Tie 2 to 1  [2_to_1_NETTIE_TH_170u]  (value not drawn)  (net tie, no BOM)
NT13  Net Tie 2 to 1  [2_to_1_NETTIE_TH_170u]  (value not drawn)  (net tie, no BOM)
NT14  Net Tie 2 to 1  [2_to_1_NETTIE_TH_170u]  (value not drawn)  (net tie, no BOM)
NT15  Net Tie 2 to 1  [2_to_1_NETTIE_TH_170u]  (value not drawn)  (net tie, no BOM)
NT16  Net Tie 2 to 1  [2_to_1_NETTIE_TH_170u]  (value not drawn)  (net tie, no BOM)
NT17  Net Tie 2 to 1  [2_to_1_NETTIE_TH_170u]  (value not drawn)  (net tie, no BOM)
NT18  Net Tie 2 to 1  [2_to_1_NETTIE_TH_170u]  (value not drawn)  (net tie, no BOM)
NT19  Net Tie 2 to 1  [2_to_1_NETTIE_TH_170u]  (value not drawn)  (net tie, no BOM)
NT20  Net Tie 2 to 1  [2_to_1_NETTIE_TH_170u]  (value not drawn)  (net tie, no BOM)
NT21  Net Tie 2 to 1  [2_to_1_NETTIE_TH_170u]  (value not drawn)  (net tie, no BOM)
NT22  Net Tie 2 to 1  [2_to_1_NETTIE_TH_170u]  (value not drawn)  (net tie, no BOM)
NT23  Net Tie 2 to 1  [2_to_1_NETTIE_TH_170u]  (value not drawn)  (net tie, no BOM)
NT24  Net Tie 2 to 1  [2_to_1_NETTIE_TH_170u]  (value not drawn)  (net tie, no BOM)
NT25  Net Tie 2 to 1  [2_to_1_NETTIE_TH_170u]  (value not drawn)  (net tie, no BOM)
NT26  Net Tie 2 to 1  [2_to_1_NETTIE_TH_170u]  (value not drawn)  (net tie, no BOM)
NT27  Net Tie 2 to 1  [2_to_1_NETTIE_TH_170u]  (value not drawn)  (net tie, no BOM)
NT28  Net Tie 2 to 1  [2_to_1_NETTIE_TH_170u]  (value not drawn)  (net tie, no BOM)
NT29  Net Tie 2 to 1  [2_to_1_NETTIE_TH_170u]  (value not drawn)  (net tie, no BOM)
NT30  Net Tie 2 to 1  [2_to_1_NETTIE_TH_170u]  (value not drawn)  (net tie, no BOM)

### Ports
DIFF_IO (in, harness DIFF_IO), DIG_IO_DIFF_A_N[1..8] (out), DIG_IO_DIFF_B_N[1..7] (out), DIG_IO_DIFF_C_N[1..8] (out), DIG_IO_DIFF_D_N[1..7] (out), DIG_IO_SINGLE (in, harness DIG_IO_SINGLE), UNTERM[0..29] (out)

### Harnesses
DIFF_IO: DIG_IO_DIFF_A_N[1..8], DIG_IO_DIFF_A_P[1..8], DIG_IO_DIFF_B_N[1..7], DIG_IO_DIFF_B_P[1..7], DIG_IO_DIFF_C_N[1..8], DIG_IO_DIFF_C_P[1..8], DIG_IO_DIFF_D_N[1..7], DIG_IO_DIFF_D_P[1..7]
DIG_IO_SINGLE: DIG_O_15V_A[1..5], DIG_O_15V_B[1..5], DIG_O_15V_C[1..5], DIG_O_15V_D[1..5], DIG_O_15V_E[1..5], DIG_O_15V_F[1..5]

### Nets
DIG_IO_DIFF_A_P1: NT1.2  [project net DIG_I_DIFF_A_P1]
DIG_IO_DIFF_A_P2: NT5.1  [project net DIG_I_DIFF_A_P2]
DIG_IO_DIFF_A_P3: NT9.2  [project net DIG_I_DIFF_A_P3]
DIG_IO_DIFF_A_P4: NT13.2  [project net DIG_I_DIFF_A_P4]
DIG_IO_DIFF_A_P5: NT17.1  [project net DIG_I_DIFF_A_P5]
DIG_IO_DIFF_A_P6: NT21.2  [project net DIG_I_DIFF_A_P6]
DIG_IO_DIFF_A_P7: NT25.1  [project net DIG_I_DIFF_A_P7]
DIG_IO_DIFF_A_P8: NT29.2  [project net DIG_I_DIFF_A_P8]
DIG_IO_DIFF_B_P1: NT2.2  [project net DIG_I_DIFF_B_P1]
DIG_IO_DIFF_B_P2: NT6.2  [project net DIG_I_DIFF_B_P2]
DIG_IO_DIFF_B_P3: NT10.1  [project net DIG_I_DIFF_B_P3]
DIG_IO_DIFF_B_P4: NT14.1  [project net DIG_I_DIFF_B_P4]
DIG_IO_DIFF_B_P5: NT18.2  [project net DIG_I_DIFF_B_P5]
DIG_IO_DIFF_B_P6: NT22.1  [project net DIG_I_DIFF_B_P6]
DIG_IO_DIFF_B_P7: NT26.1  [project net DIG_I_DIFF_B_P7]
DIG_IO_DIFF_C_P1: NT3.2  [project net DIG_I_DIFF_C_P1]
DIG_IO_DIFF_C_P2: NT7.1  [project net DIG_I_DIFF_C_P2]
DIG_IO_DIFF_C_P3: NT11.2  [project net DIG_I_DIFF_C_P3]
DIG_IO_DIFF_C_P4: NT15.1  [project net DIG_I_DIFF_C_P4]
DIG_IO_DIFF_C_P5: NT19.1  [project net DIG_I_DIFF_C_P5]
DIG_IO_DIFF_C_P6: NT23.2  [project net DIG_I_DIFF_C_P6]
DIG_IO_DIFF_C_P7: NT27.2  [project net DIG_I_DIFF_C_P7]
DIG_IO_DIFF_C_P8: NT30.2  [project net DIG_I_DIFF_C_P8]
DIG_IO_DIFF_D_P1: NT4.1  [project net DIG_I_DIFF_D_P1]
DIG_IO_DIFF_D_P2: NT8.1  [project net DIG_I_DIFF_D_P2]
DIG_IO_DIFF_D_P3: NT12.2  [project net DIG_I_DIFF_D_P3]
DIG_IO_DIFF_D_P4: NT16.1  [project net DIG_I_DIFF_D_P4]
DIG_IO_DIFF_D_P5: NT20.1  [project net DIG_I_DIFF_D_P5]
DIG_IO_DIFF_D_P6: NT24.1  [project net DIG_I_DIFF_D_P6]
DIG_IO_DIFF_D_P7: NT28.1  [project net DIG_I_DIFF_D_P7]
DIG_IO_SINGLE_A1: NT1.1
DIG_IO_SINGLE_A2: NT7.2
DIG_IO_SINGLE_A3: NT13.1
DIG_IO_SINGLE_A4: NT19.2
DIG_IO_SINGLE_A5: NT25.2
DIG_IO_SINGLE_B1: NT2.1
DIG_IO_SINGLE_B2: NT8.2
DIG_IO_SINGLE_B3: NT14.2
DIG_IO_SINGLE_B4: NT20.2
DIG_IO_SINGLE_B5: NT26.2
DIG_IO_SINGLE_C1: NT3.1
DIG_IO_SINGLE_C2: NT9.1
DIG_IO_SINGLE_C3: NT15.2
DIG_IO_SINGLE_C4: NT21.1
DIG_IO_SINGLE_C5: NT27.1
DIG_IO_SINGLE_D1: NT4.2
DIG_IO_SINGLE_D2: NT10.2
DIG_IO_SINGLE_D3: NT16.2
DIG_IO_SINGLE_D4: NT22.2
DIG_IO_SINGLE_D5: NT28.2
DIG_IO_SINGLE_E1: NT5.2
DIG_IO_SINGLE_E2: NT11.1
DIG_IO_SINGLE_E3: NT17.2
DIG_IO_SINGLE_E4: NT23.1
DIG_IO_SINGLE_E5: NT29.1
DIG_IO_SINGLE_F1: NT6.1
DIG_IO_SINGLE_F2: NT12.1
DIG_IO_SINGLE_F3: NT18.1
DIG_IO_SINGLE_F4: NT24.2
DIG_IO_SINGLE_F5: NT30.1
UNTERM0: NT1.3
UNTERM1: NT2.3
UNTERM2: NT3.3
UNTERM3: NT4.3
UNTERM4: NT5.3
UNTERM5: NT6.3
UNTERM6: NT7.3
UNTERM7: NT8.3
UNTERM8: NT9.3
UNTERM9: NT10.3
UNTERM10: NT11.3
UNTERM11: NT12.3
UNTERM12: NT13.3
UNTERM13: NT14.3
UNTERM14: NT15.3
UNTERM15: NT16.3
UNTERM16: NT17.3
UNTERM17: NT18.3
UNTERM18: NT19.3
UNTERM19: NT20.3
UNTERM20: NT21.3
UNTERM21: NT22.3
UNTERM22: NT23.3
UNTERM23: NT24.3
UNTERM24: NT25.3
UNTERM25: NT26.3
UNTERM26: NT27.3
UNTERM27: NT28.3
UNTERM28: NT29.3
UNTERM29: NT30.3

### Buses and harness runs
bus DIG_IO_DIFF_A_N[1..8]
bus DIG_IO_DIFF_A_N[1..8] = port DIG_IO_DIFF_A_N[1..8]
bus DIG_IO_DIFF_A_P[1..8]
bus DIG_IO_DIFF_B_N[1..7]
bus DIG_IO_DIFF_B_N[1..7] = port DIG_IO_DIFF_B_N[1..7]
bus DIG_IO_DIFF_B_P[1..7]
bus DIG_IO_DIFF_C_N[1..8]
bus DIG_IO_DIFF_C_N[1..8] = port DIG_IO_DIFF_C_N[1..8]
bus DIG_IO_DIFF_C_P[1..8]
bus DIG_IO_DIFF_D_N[1..7]
bus DIG_IO_DIFF_D_N[1..7] = port DIG_IO_DIFF_D_N[1..7]
bus DIG_IO_DIFF_D_P[1..7]
bus DIG_IO_SINGLE_A[1..5]
bus DIG_IO_SINGLE_B[1..5]
bus DIG_IO_SINGLE_C[1..5]
bus DIG_IO_SINGLE_D[1..5]
bus DIG_IO_SINGLE_E[1..5]
bus DIG_IO_SINGLE_F[1..5]
bus UNTERM[0..29] = port UNTERM[0..29]

### Notes on the sheet
- Title
- Size:
- Date:
- A4
- Revision:
- Time:
- Sheet
- of
- Author:
- Project:
- (in symbol Net Tie 2 to 1) NetTie

### Library data of the parts
NT1-NT30 = Net Tie 2 to 1: Net Tie 2 to 1. Joints two nets without producing a DRC error; PartID: 1; Created On: 26.02.2021 18:37:51; Component Type: Net Tie 2 to 1; Last Updated: 26.02.2021 18:44:55; Type: Net Tie (No BOM); Created by: T. Wendt; Live Cycle Status: 1

## Sheet TermSingleAndDiff.SchDoc
size A4; Author: T. Wendt; CompanyName: Technische Hochschule Nürnberg Georg Simon Ohm; Address1: Fürther Straße 250; Address2: 90429 Nürnberg; Address3: GERMANY; DocumentNumber: 13; SheetNumber: 13; SheetTotal: 16; CompanyName2: Institut ELSYS
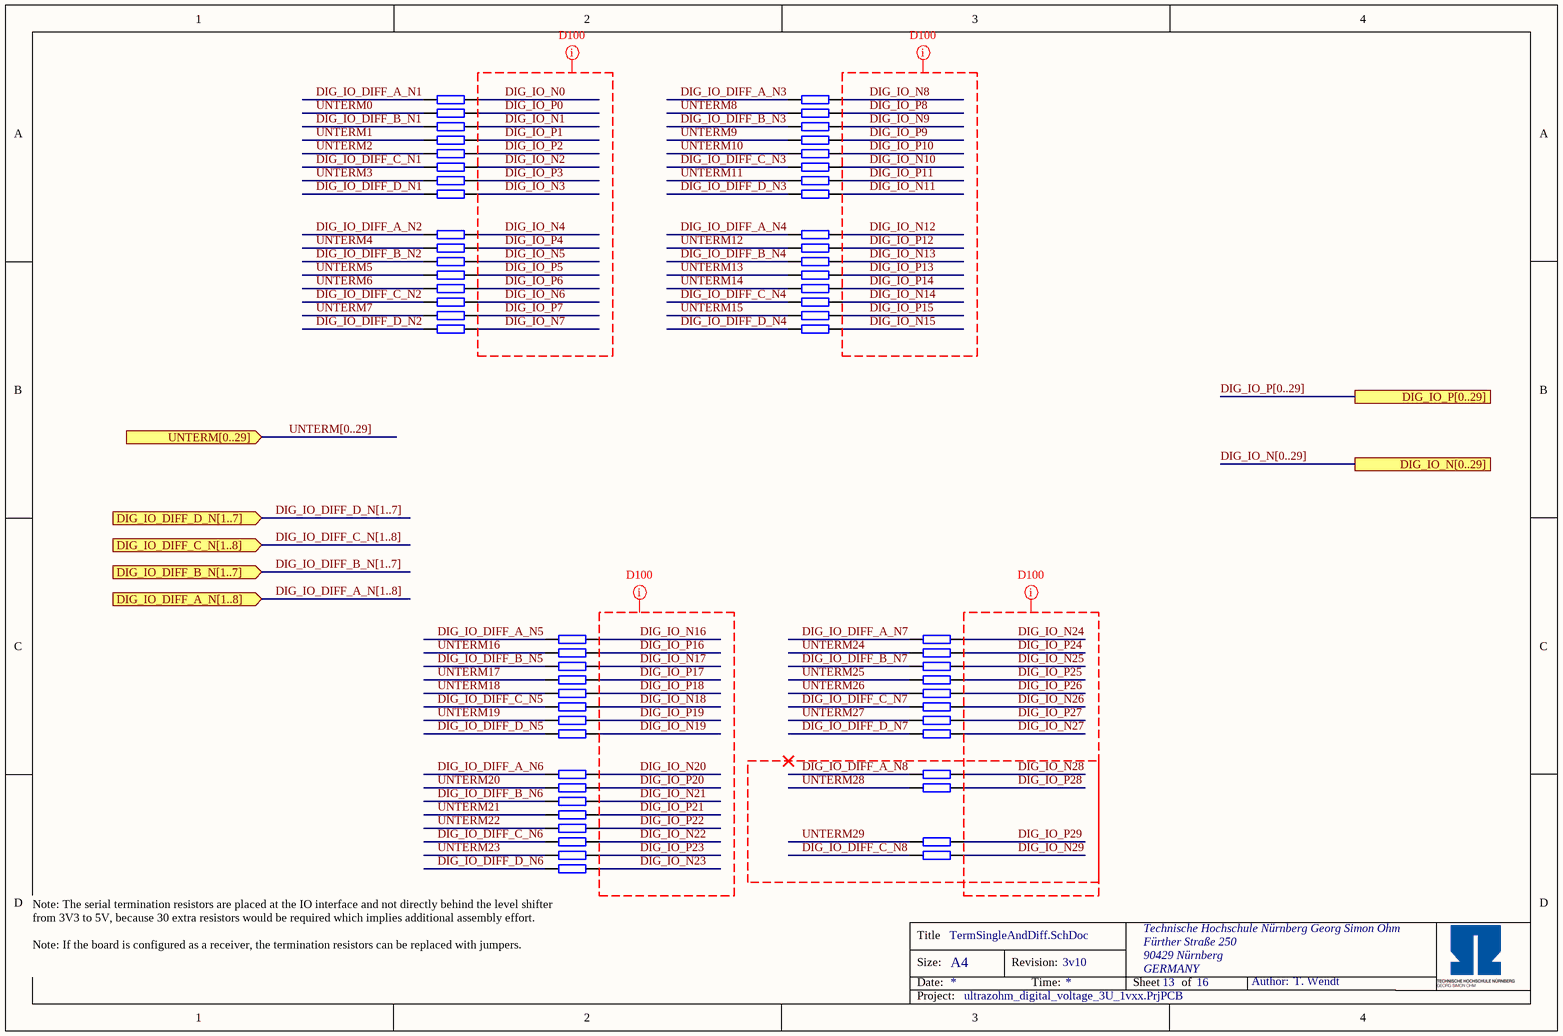
[diagram p14: TermSingleAndDiff.SchDoc]

### Parts
R81  47R  [RES 0603_1608]  (value not drawn)
R82  47R  [RES 0603_1608]  (value not drawn)
R83  47R  [RES 0603_1608]  (value not drawn)
R84  47R  [RES 0603_1608]  (value not drawn)
R85  47R  [RES 0603_1608]  (value not drawn)
R86  47R  [RES 0603_1608]  (value not drawn)
R87  47R  [RES 0603_1608]  (value not drawn)
R88  47R  [RES 0603_1608]  (value not drawn)
R89  47R  [RES 0603_1608]  (value not drawn)
R90  47R  [RES 0603_1608]  (value not drawn)
R91  47R  [RES 0603_1608]  (value not drawn)
R92  47R  [RES 0603_1608]  (value not drawn)
R93  47R  [RES 0603_1608]  (value not drawn)
R94  47R  [RES 0603_1608]  (value not drawn)
R95  47R  [RES 0603_1608]  (value not drawn)
R96  47R  [RES 0603_1608]  (value not drawn)
R97  47R  [RES 0603_1608]  (value not drawn)
R98  47R  [RES 0603_1608]  (value not drawn)
R99  47R  [RES 0603_1608]  (value not drawn)
R100  47R  [RES 0603_1608]  (value not drawn)
R101  47R  [RES 0603_1608]  (value not drawn)
R102  47R  [RES 0603_1608]  (value not drawn)
R103  47R  [RES 0603_1608]  (value not drawn)
R104  47R  [RES 0603_1608]  (value not drawn)
R105  47R  [RES 0603_1608]  (value not drawn)
R106  47R  [RES 0603_1608]  (value not drawn)
R107  47R  [RES 0603_1608]  (value not drawn)
R108  47R  [RES 0603_1608]  (value not drawn)
R109  47R  [RES 0603_1608]  (value not drawn)
R110  47R  [RES 0603_1608]  (value not drawn)
R111  47R  [RES 0603_1608]  (value not drawn)
R112  47R  [RES 0603_1608]  (value not drawn)
R113  47R  [RES 0603_1608]  (value not drawn)
R114  47R  [RES 0603_1608]  (value not drawn)
R115  47R  [RES 0603_1608]  (value not drawn)
R116  47R  [RES 0603_1608]  (value not drawn)
R117  47R  [RES 0603_1608]  (value not drawn)
R118  47R  [RES 0603_1608]  (value not drawn)
R119  47R  [RES 0603_1608]  (value not drawn)
R120  47R  [RES 0603_1608]  (value not drawn)
R121  47R  [RES 0603_1608]  (value not drawn)
R122  47R  [RES 0603_1608]  (value not drawn)
R123  47R  [RES 0603_1608]  (value not drawn)
R124  47R  [RES 0603_1608]  (value not drawn)
R125  47R  [RES 0603_1608]  (value not drawn)
R126  47R  [RES 0603_1608]  (value not drawn)
R127  47R  [RES 0603_1608]  (value not drawn)
R128  47R  [RES 0603_1608]  (value not drawn)
R129  47R  [RES 0603_1608]  (value not drawn)
R130  47R  [RES 0603_1608]  (value not drawn)
R131  47R  [RES 0603_1608]  (value not drawn)
R132  47R  [RES 0603_1608]  (value not drawn)
R133  47R  [RES 0603_1608]  (value not drawn)
R134  47R  [RES 0603_1608]  (value not drawn)
R135  47R  [RES 0603_1608]  (value not drawn)
R136  47R  [RES 0603_1608]  (value not drawn)
R137  47R  [RES 0603_1608]  (value not drawn)
R138  47R  [RES 0603_1608]  (value not drawn)
R139  47R  [RES 0603_1608]  (value not drawn)
R140  47R  [RES 0603_1608]  (value not drawn)

### Ports
DIG_IO_DIFF_A_N[1..8] (in), DIG_IO_DIFF_B_N[1..7] (in), DIG_IO_DIFF_C_N[1..8] (in), DIG_IO_DIFF_D_N[1..7] (in), DIG_IO_N[0..29], DIG_IO_P[0..29], UNTERM[0..29] (in)

### Nets
DIG_IO_DIFF_A_N1: R81.1  [project net DIG_I_DIFF_A_N1]
DIG_IO_DIFF_A_N2: R89.1  [project net DIG_I_DIFF_A_N2]
DIG_IO_DIFF_A_N3: R113.1  [project net DIG_I_DIFF_A_N3]
DIG_IO_DIFF_A_N4: R121.1  [project net DIG_I_DIFF_A_N4]
DIG_IO_DIFF_A_N5: R97.1  [project net DIG_I_DIFF_A_N5]
DIG_IO_DIFF_A_N6: R105.1  [project net DIG_I_DIFF_A_N6]
DIG_IO_DIFF_A_N7: R129.1  [project net DIG_I_DIFF_A_N7]
DIG_IO_DIFF_A_N8: R137.1  [project net DIG_I_DIFF_A_N8]
DIG_IO_DIFF_B_N1: R83.1  [project net DIG_I_DIFF_B_N1]
DIG_IO_DIFF_B_N2: R91.1  [project net DIG_I_DIFF_B_N2]
DIG_IO_DIFF_B_N3: R115.1  [project net DIG_I_DIFF_B_N3]
DIG_IO_DIFF_B_N4: R123.1  [project net DIG_I_DIFF_B_N4]
DIG_IO_DIFF_B_N5: R99.1  [project net DIG_I_DIFF_B_N5]
DIG_IO_DIFF_B_N6: R107.1  [project net DIG_I_DIFF_B_N6]
DIG_IO_DIFF_B_N7: R131.1  [project net DIG_I_DIFF_B_N7]
DIG_IO_DIFF_C_N1: R86.1  [project net DIG_I_DIFF_C_N1]
DIG_IO_DIFF_C_N2: R94.1  [project net DIG_I_DIFF_C_N2]
DIG_IO_DIFF_C_N3: R118.1  [project net DIG_I_DIFF_C_N3]
DIG_IO_DIFF_C_N4: R126.1  [project net DIG_I_DIFF_C_N4]
DIG_IO_DIFF_C_N5: R102.1  [project net DIG_I_DIFF_C_N5]
DIG_IO_DIFF_C_N6: R110.1  [project net DIG_I_DIFF_C_N6]
DIG_IO_DIFF_C_N7: R134.1  [project net DIG_I_DIFF_C_N7]
DIG_IO_DIFF_C_N8: R140.1  [project net DIG_I_DIFF_C_N8]
DIG_IO_DIFF_D_N1: R88.1  [project net DIG_I_DIFF_D_N1]
DIG_IO_DIFF_D_N2: R96.1  [project net DIG_I_DIFF_D_N2]
DIG_IO_DIFF_D_N3: R120.1  [project net DIG_I_DIFF_D_N3]
DIG_IO_DIFF_D_N4: R128.1  [project net DIG_I_DIFF_D_N4]
DIG_IO_DIFF_D_N5: R104.1  [project net DIG_I_DIFF_D_N5]
DIG_IO_DIFF_D_N6: R112.1  [project net DIG_I_DIFF_D_N6]
DIG_IO_DIFF_D_N7: R136.1  [project net DIG_I_DIFF_D_N7]
DIG_IO_N0: R81.2
DIG_IO_N1: R83.2
DIG_IO_N2: R86.2
DIG_IO_N3: R88.2
DIG_IO_N4: R89.2
DIG_IO_N5: R91.2
DIG_IO_N6: R94.2
DIG_IO_N7: R96.2
DIG_IO_N8: R113.2
DIG_IO_N9: R115.2
DIG_IO_N10: R118.2
DIG_IO_N11: R120.2
DIG_IO_N12: R121.2
DIG_IO_N13: R123.2
DIG_IO_N14: R126.2
DIG_IO_N15: R128.2
DIG_IO_N16: R97.2
DIG_IO_N17: R99.2
DIG_IO_N18: R102.2
DIG_IO_N19: R104.2
DIG_IO_N20: R105.2
DIG_IO_N21: R107.2
DIG_IO_N22: R110.2
DIG_IO_N23: R112.2
DIG_IO_N24: R129.2
DIG_IO_N25: R131.2
DIG_IO_N26: R134.2
DIG_IO_N27: R136.2
DIG_IO_N28: R137.2
DIG_IO_N29: R140.2
DIG_IO_P0: R82.2
DIG_IO_P1: R84.2
DIG_IO_P2: R85.2
DIG_IO_P3: R87.2
DIG_IO_P4: R90.2
DIG_IO_P5: R92.2
DIG_IO_P6: R93.2
DIG_IO_P7: R95.2
DIG_IO_P8: R114.2
DIG_IO_P9: R116.2
DIG_IO_P10: R117.2
DIG_IO_P11: R119.2
DIG_IO_P12: R122.2
DIG_IO_P13: R124.2
DIG_IO_P14: R125.2
DIG_IO_P15: R127.2
DIG_IO_P16: R98.2
DIG_IO_P17: R100.2
DIG_IO_P18: R101.2
DIG_IO_P19: R103.2
DIG_IO_P20: R106.2
DIG_IO_P21: R108.2
DIG_IO_P22: R109.2
DIG_IO_P23: R111.2
DIG_IO_P24: R130.2
DIG_IO_P25: R132.2
DIG_IO_P26: R133.2
DIG_IO_P27: R135.2
DIG_IO_P28: R138.2
DIG_IO_P29: R139.2
UNTERM0: R82.1
UNTERM1: R84.1
UNTERM2: R85.1
UNTERM3: R87.1
UNTERM4: R90.1
UNTERM5: R92.1
UNTERM6: R93.1
UNTERM7: R95.1
UNTERM8: R114.1
UNTERM9: R116.1
UNTERM10: R117.1
UNTERM11: R119.1
UNTERM12: R122.1
UNTERM13: R124.1
UNTERM14: R125.1
UNTERM15: R127.1
UNTERM16: R98.1
UNTERM17: R100.1
UNTERM18: R101.1
UNTERM19: R103.1
UNTERM20: R106.1
UNTERM21: R108.1
UNTERM22: R109.1
UNTERM23: R111.1
UNTERM24: R130.1
UNTERM25: R132.1
UNTERM26: R133.1
UNTERM27: R135.1
UNTERM28: R138.1
UNTERM29: R139.1

### Buses and harness runs
bus DIG_IO_DIFF_A_N[1..8] = port DIG_IO_DIFF_A_N[1..8]
bus DIG_IO_DIFF_B_N[1..7] = port DIG_IO_DIFF_B_N[1..7]
bus DIG_IO_DIFF_C_N[1..8] = port DIG_IO_DIFF_C_N[1..8]
bus DIG_IO_DIFF_D_N[1..7] = port DIG_IO_DIFF_D_N[1..7]
bus DIG_IO_N[0..29] = port DIG_IO_N[0..29]
bus DIG_IO_P[0..29] = port DIG_IO_P[0..29]
bus UNTERM[0..29] = port UNTERM[0..29]

### Layout directives
net class D100_alt: DIG_IO_N0, DIG_IO_N1, DIG_IO_N2, DIG_IO_N3, DIG_IO_N4, DIG_IO_N5, DIG_IO_N6, DIG_IO_N7, DIG_IO_N8, DIG_IO_N9, DIG_IO_N10, DIG_IO_N11, DIG_IO_N12, DIG_IO_N13, DIG_IO_N14, DIG_IO_N15, DIG_IO_N16, DIG_IO_N17, DIG_IO_N18, DIG_IO_N19, DIG_IO_N20, DIG_IO_N21, DIG_IO_N22, DIG_IO_N23, DIG_IO_N24, DIG_IO_N25, DIG_IO_N26, DIG_IO_N27, DIG_IO_N28, DIG_IO_N29, DIG_IO_P0, DIG_IO_P1, DIG_IO_P2, DIG_IO_P3, DIG_IO_P4, DIG_IO_P5, DIG_IO_P6, DIG_IO_P7, DIG_IO_P8, DIG_IO_P9, DIG_IO_P10, DIG_IO_P11, DIG_IO_P12, DIG_IO_P13, DIG_IO_P14, DIG_IO_P15, DIG_IO_P16, DIG_IO_P17, DIG_IO_P18, DIG_IO_P19, DIG_IO_P20, DIG_IO_P21, DIG_IO_P22, DIG_IO_P23, DIG_IO_P24, DIG_IO_P25, DIG_IO_P26, DIG_IO_P27, DIG_IO_P28, DIG_IO_P29

### Notes on the sheet
- Note: The serial termination resistors are placed at the IO interface and not directly behind the level shifter from 3V3 to 5V, because 30 extra resistors would be required which implies additional assembly effort.
  Note: If the board is configured as a receiver, the termination resistors can be replaced with jumpers.
- Title
- Size:
- Date:
- A4
- Revision:
- Time:
- Sheet
- of
- Author:
- Project:

### Library data of the parts
R81-R140 = RK73B1JTTDD470J: SMD resistor E24 series; Manufacturer: KOA Speer; Tolerance: 5%; Created from: MGremer; Manufacturer Part Number: RK73B1JTTDD470J; PartID: 42; Created On: 14.12.2020 16:17:14; ComponentLink1Description: Datasheet; ComponentLink1URL: https://www.mouser.de/datasheet/2/219/RK73B-1825463.pdf; Component Type: SMD resistor; Device Package: 0603; Last Updated: 04.03.2021 09:09:42; Mounting Type: SMD; Supplier 1: Mouser; Supplier Part Number 1: 660-RK73B1JTTDD470J; Supplier 2: LCSC; Supplier Part Number 2: C23182; Type: Resistor; Value: 47R; Live Cycle Status: 1; Stock number: Labor SMD Container; LCSC Part Number: C23182

## Sheet DigitalCarrierPlug.SchDoc
size A4; Author: T. Wendt; CompanyName: Technische Hochschule Nürnberg Georg Simon Ohm; Address1: Fürther Straße 250; Address2: 90429 Nürnberg; Address3: GERMANY; DocumentNumber: 14; SheetNumber: 14; SheetTotal: 16; CompanyName2: Institut ELSYS
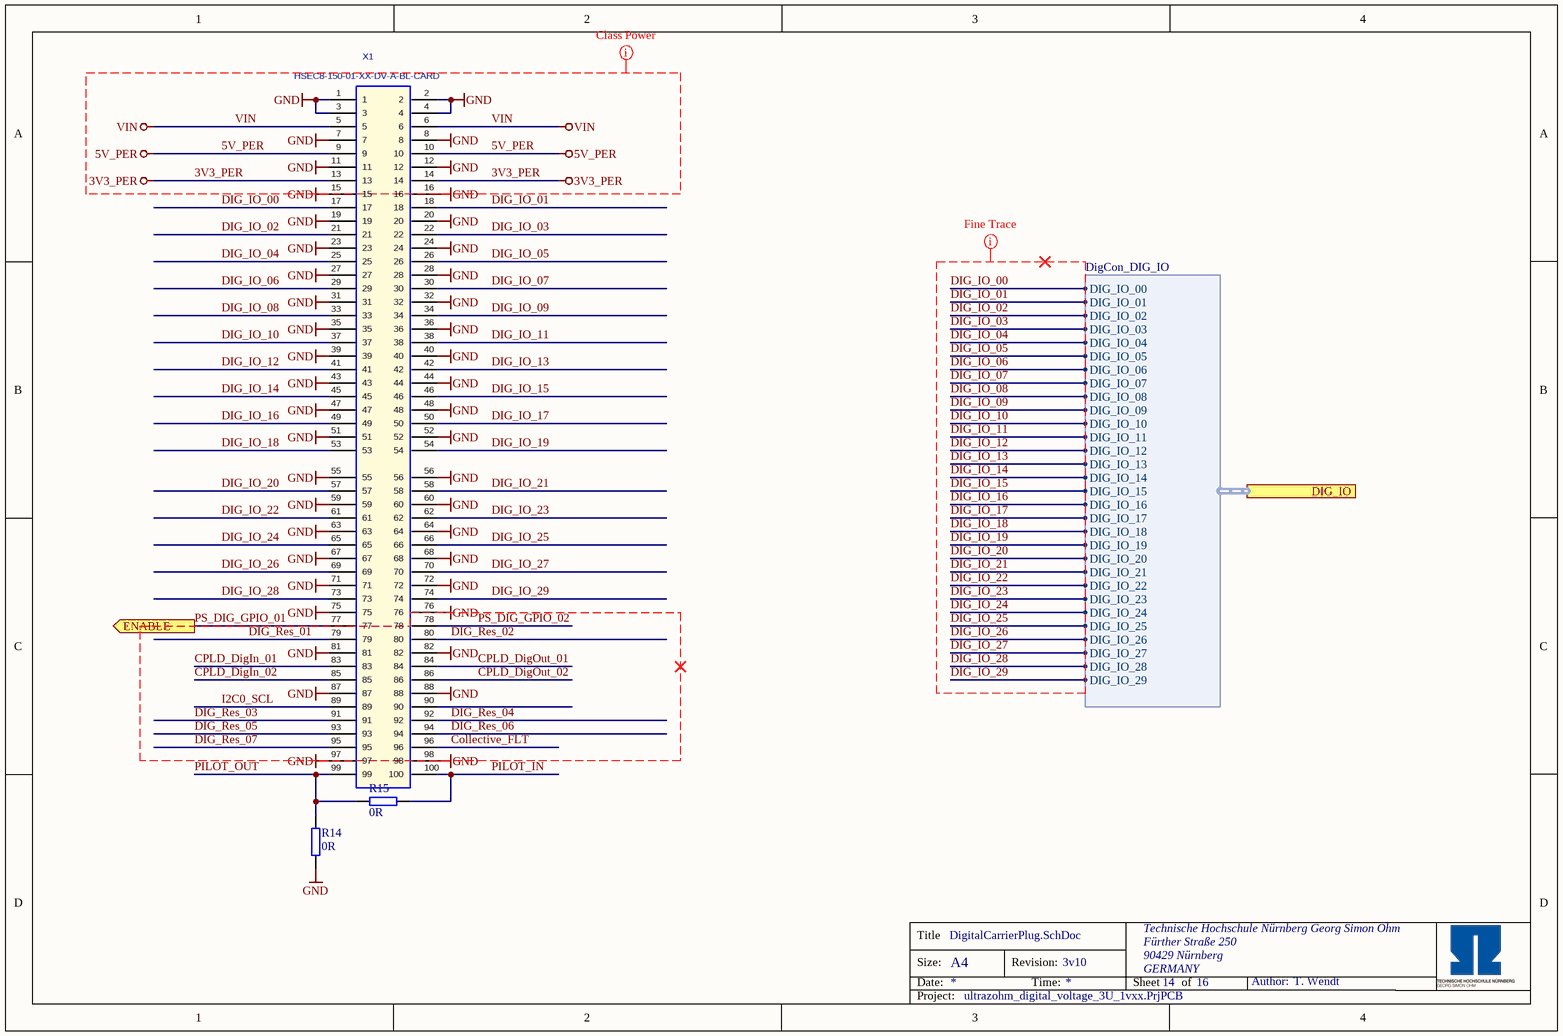
[diagram p15: DigitalCarrierPlug.SchDoc]

### Parts
R14  0R  [RES 0603_1608]
R15  0R  [RES 0603_1608]
X1  HSEC8-150-01-XX-DV-A-BL-CARD  [HSEC8-150-01-XX-DV-A-BL-CARD]  (no BOM)

### Ports
DIG_IO (harness DigCon_DIG_IO), ENABLE (out)

### Harnesses
DigCon_DIG_IO: DIG_IO_00, DIG_IO_01, DIG_IO_02, DIG_IO_03, DIG_IO_04, DIG_IO_05, DIG_IO_06, DIG_IO_07, DIG_IO_08, DIG_IO_09, DIG_IO_10, DIG_IO_11, DIG_IO_12, DIG_IO_13, DIG_IO_14, DIG_IO_15, DIG_IO_16, DIG_IO_17, DIG_IO_18, DIG_IO_19, DIG_IO_20, DIG_IO_21, DIG_IO_22, DIG_IO_23, DIG_IO_24, DIG_IO_25, DIG_IO_26, DIG_IO_27, DIG_IO_28, DIG_IO_29

### Nets
3V3_PER: X1.13 X1.14
5V_PER: X1.9 X1.10
GND: R14.1 X1.1 X1.2 X1.3 X1.4 X1.7 X1.8 X1.11 X1.12 X1.15 X1.16 X1.19 X1.20 X1.23 X1.24 X1.27 X1.28 X1.31 X1.32 X1.35 X1.36 X1.39 X1.40 X1.43 X1.44 X1.47 X1.48 X1.51 X1.52 X1.55 X1.56 X1.59 X1.60 X1.63 X1.64 X1.67 X1.68 X1.71 X1.72 X1.75 X1.76 X1.81 X1.82 X1.87 X1.88 X1.97 X1.98
VIN: X1.5 X1.6
Collective_FLT: X1.96
CPLD_DigIn_01: X1.83
CPLD_DigIn_02: X1.85
CPLD_DigOut_01: X1.84
CPLD_DigOut_02: X1.86
DIG_IO_00: X1.17 ; port DIG_IO.DIG_IO_00
DIG_IO_01: X1.18 ; port DIG_IO.DIG_IO_01
DIG_IO_02: X1.21 ; port DIG_IO.DIG_IO_02
DIG_IO_03: X1.22 ; port DIG_IO.DIG_IO_03
DIG_IO_04: X1.25 ; port DIG_IO.DIG_IO_04
DIG_IO_05: X1.26 ; port DIG_IO.DIG_IO_05
DIG_IO_06: X1.29 ; port DIG_IO.DIG_IO_06
DIG_IO_07: X1.30 ; port DIG_IO.DIG_IO_07
DIG_IO_08: X1.33 ; port DIG_IO.DIG_IO_08
DIG_IO_09: X1.34 ; port DIG_IO.DIG_IO_09
DIG_IO_10: X1.37 ; port DIG_IO.DIG_IO_10
DIG_IO_11: X1.38 ; port DIG_IO.DIG_IO_11
DIG_IO_12: X1.41 ; port DIG_IO.DIG_IO_12
DIG_IO_13: X1.42 ; port DIG_IO.DIG_IO_13
DIG_IO_14: X1.45 ; port DIG_IO.DIG_IO_14
DIG_IO_15: X1.46 ; port DIG_IO.DIG_IO_15
DIG_IO_16: X1.49 ; port DIG_IO.DIG_IO_16
DIG_IO_17: X1.50 ; port DIG_IO.DIG_IO_17
DIG_IO_18: X1.53 ; port DIG_IO.DIG_IO_18
DIG_IO_19: X1.54 ; port DIG_IO.DIG_IO_19
DIG_IO_20: X1.57 ; port DIG_IO.DIG_IO_20
DIG_IO_21: X1.58 ; port DIG_IO.DIG_IO_21
DIG_IO_22: X1.61 ; port DIG_IO.DIG_IO_22
DIG_IO_23: X1.62 ; port DIG_IO.DIG_IO_23
DIG_IO_24: X1.65 ; port DIG_IO.DIG_IO_24
DIG_IO_25: X1.66 ; port DIG_IO.DIG_IO_25
DIG_IO_26: X1.69 ; port DIG_IO.DIG_IO_26
DIG_IO_27: X1.70 ; port DIG_IO.DIG_IO_27
DIG_IO_28: X1.73 ; port DIG_IO.DIG_IO_28
DIG_IO_29: X1.74 ; port DIG_IO.DIG_IO_29
DIG_Res_01: X1.79
DIG_Res_02: X1.80
DIG_Res_03: X1.91
DIG_Res_04: X1.92
DIG_Res_05: X1.93
DIG_Res_06: X1.94
DIG_Res_07: X1.95
I2C0_SCL: X1.89
PILOT_IN: R15.1 X1.100
PILOT_OUT: R14.2 R15.2 X1.99
PS_DIG_GPIO_01: X1.77 ; port ENABLE
PS_DIG_GPIO_02: X1.78

Not connected (* = marked no-connect by the designer): X1 90

### Layout directives
net class Power: 3V3_PER, 5V_PER, GND, VIN
net class Fine Trace: DIG_IO_00, DIG_IO_01, DIG_IO_02, DIG_IO_03, DIG_IO_04, DIG_IO_05, DIG_IO_06, DIG_IO_07, DIG_IO_08, DIG_IO_09, DIG_IO_10, DIG_IO_11, DIG_IO_12, DIG_IO_13, DIG_IO_14, DIG_IO_15, DIG_IO_16, DIG_IO_17, DIG_IO_18, DIG_IO_19, DIG_IO_20, DIG_IO_21, DIG_IO_22, DIG_IO_23, DIG_IO_24, DIG_IO_25, DIG_IO_26, DIG_IO_27, DIG_IO_28, DIG_IO_29

### Notes on the sheet
- Title
- Size:
- Date:
- A4
- Revision:
- Time:
- Sheet
- of
- Author:
- Project:

### Library data of the parts
R14 R15 = RC0603JR-070RL: as R21-R50 on sheet SignalBundling; Manufacturer Part Number: RC0603JR-070RL; PartID: 1; Created On: 14.12.2020 16:17:14; ComponentLink1Description: Datasheet; ComponentLink1URL: https://www.mouser.de/datasheet/2/447/PYu-RC_Group_51_RoHS_L_10-1664068.pdf; Component Type: SMD resistor; Device Package: 0603; Last Updated: 04.03.2021 09:09:42; Mounting Type: SMD; Supplier 1: Mouser; Supplier Part Number 1: 603-RC0603JR-070RL; Type: Resistor; Value: 0R; Live Cycle Status: 1; LCSC Part Number: C21189; Stock number: Labor SMD Container; Supplier 2: LCSC; Supplier Part Number 2: C21189
X1 = HSEC8-150-01-XX-DV-A-BL-CARD: Mating Card Layout for HSEC8-150-01-XX-DV-A-BL; Manufacturer: SAMTEC; Created from: T. Wendt; Number of positions: 100; Created: 2018_04_23_AGeiger; Category: SAMTEC; Manufacturer Part Number: HSEC8-150-01-XX-DV-A-BL-CARD; PartID: 2; Created On: 26.02.2021 16:36:12; ComponentLink1Description: Homepage; ComponentLink1URL: https://www.samtec.com/products/hsec8-dp; Component Type: Board to Board Connector; Device Package: PCB Shape; Last Updated: 26.02.2021 16:37:20; Mounting Type: PCB Shape; Series: HSEC8; Supplier 1: SAMTEC; Supplier Part Number 1: NA; Type: Board to Board Connector; Live Cycle Status: 1; Stock number: not stored; Number of rows: 2

## Sheet 15V_PowerSupply.SchDoc
size A4; Author: T. Wendt; CompanyName: Technische Hochschule Nürnberg Georg Simon Ohm; Address1: Fürther Straße 250; Address2: 90429 Nürnberg; Address3: GERMANY; DocumentNumber: 16; SheetNumber: 16; SheetTotal: 16; CompanyName2: Institut ELSYS
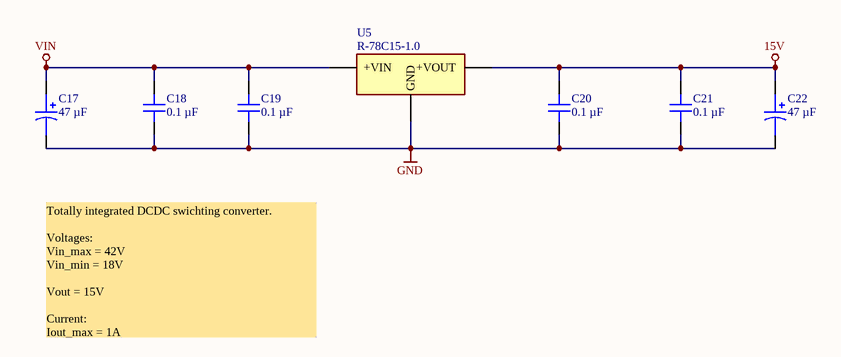
[diagram p16: 15V_PowerSupply.SchDoc]

### Parts
C17  47 µF  [CAPAE830X650N]
C18  0.1 µF  [C_0603]
C19  0.1 µF  [C_0603]
C20  0.1 µF  [C_0603]
C21  0.1 µF  [C_0603]
C22  47 µF  [CAPAE830X650N]
U5  R-78C15-1.0  [R78C1510]

### Nets
15V: C20.2 C21.2 C22.1 U5.3(+VOUT)
GND: C17.2 C18.1 C19.1 C20.1 C21.1 C22.2 U5.2(GND)
VIN: C17.1 C18.2 C19.2 U5.1(+VIN)

### Notes on the sheet
- Totally integrated DCDC swichting converter.
  Voltages:
  Vin_max = 42V
  Vin_min = 18V
  Vout = 15V
  Current:
  Iout_max = 1A
- Title
- Size:
- Date:
- A4
- Revision:
- Time:
- Sheet
- of
- Author:
- Project:

### Library data of the parts
C17 C22 = EEE-1VA470P: Capacitor, 47µF, 35VDC Al Electrolyt; Manufacturer: Panasonic; Tolerance: 20 %; Created from: T. Wendt; Manufacturer Part Number: EEE-1VA470P; PartID: 63; Created On: 26.02.2021 15:32:07; ComponentLink1Description: Datasheet; ComponentLink1URL: https://industrial.panasonic.com/cdbs/www-data/pdf/RDE0000/ABA0000C1145.pdf; Component Type: Capacitor Al Electrolyt; Last Updated: 04.03.2021 09:24:01; Mounting Type: SMD; Operating Temperature: -40 - 85°C; Series: S Series; Supplier 1: Mouser; Supplier Part Number 1: 667-EEE-1VA470P; Type: Capacitor; Voltage Rating: 35 VDC; Value: 47 µF; Live Cycle Status: 1; Stock number: not stored; LCSC Part Number: C336247; Supplier 2: LCSC; Supplier Part Number 2: C336247
C18-C21 = C0603X104K5RAC7411: Capacitor 0603, 50 VDC, 0.1 µF, X7R; Manufacturer: KEMET; Tolerance: 10 %; Voltage Rating: 50 VDC; Created from: MGremer; Manufacturer Part Number: C0603X104K5RAC7411; PartID: 3; Created On: 20.12.2020 13:54:13; ComponentLink1Description: Datasheet; ComponentLink1URL: https://www.mouser.de/datasheet/2/212/1/KEM_C1013_X7R_FT_CAP_SMD-1103280.pdf; Component Type: Capacitor 0603; Device Package: 0603; Last Updated: 04.03.2021 09:24:28; Mounting Type: SMD; Operating Temperature: -55 - 125°C; Series: SMD Comm X7R Flex; Supplier 1: Mouser; Supplier Part Number 1: 80-C0603X104K5R7411; Type: Capacitor; Value: 0.1 µF; Live Cycle Status: 1; Stock number: Labor SMD Container; LCSC Part Number: C14663; Supplier 2: LCSC; Supplier Part Number 2: C14663
U5 = R-78C15-1.0: Not isolated DCDC Converter 15 V Output, 1 A, 18 - 42 V Input; Manufacturer: RECOM; Value: 15V@1A; Created from: T. Wendt; Manufacturer Part Number: R-78C15-1.0; PartID: 12; Created On: 26.02.2021 15:53:07; ComponentLink1Description: Datasheet; ComponentLink1URL: https://recom-power.com/pdf/Innoline/R-78C-1.0.pdf; Component Type: Not isolated DCDC Converter; Device Package: SIP-3; Last Updated: 26.02.2021 15:53:07; Mounting Type: THT; Operating Temperature: -40 - 85 °C; Series: R-78C-1.0; Supplier 1: Mouser; Supplier Part Number 1: 919-R-78C15-1.0; Type: not isolated DCDC converter; Live Cycle Status: 1; Stock number: not stored